# Altium project IMX6 DEV BOARD.PrjPcb (part 1 of 4)
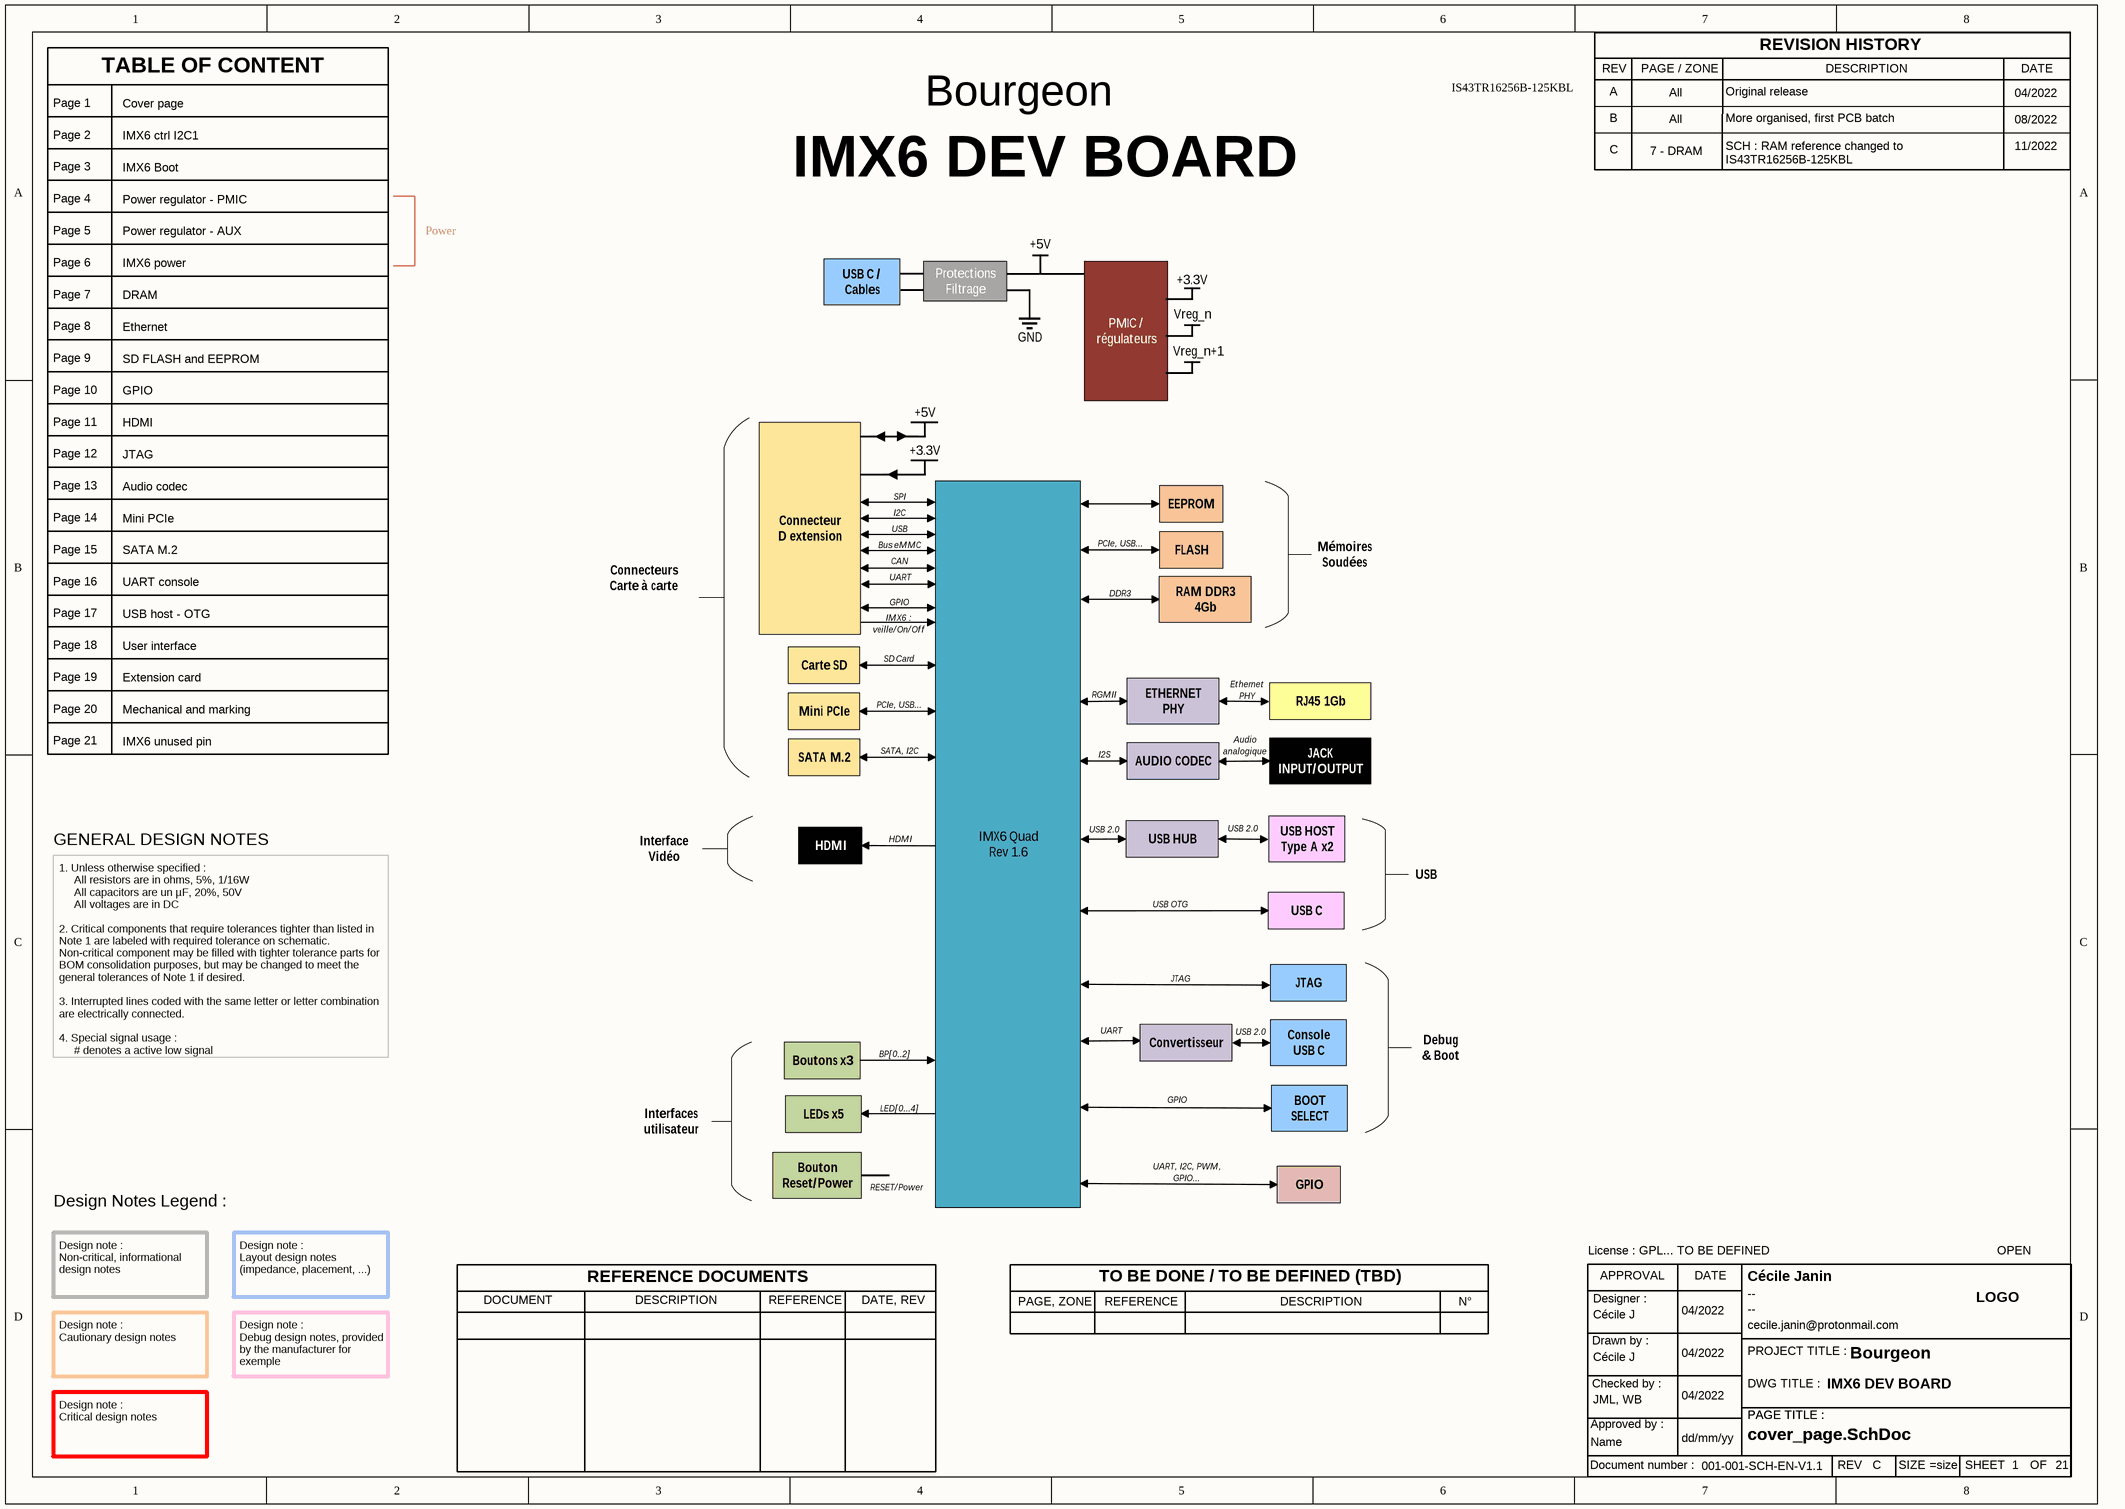
[diagram p0: cover_page.SchDoc]
society_phone: --; society_name: Cécile Janin; society_email_or_website: cecile.janin@protonmail.com; society_address: --; SCH_sensibility: OPEN; SCH_rev: C; SCH_license: License : GPL... TO BE DEFINED; SCH_drawn_by: Cécile J; SCH_doc_number: 001-001-SCH-EN-V1.1; SCH_design_by: Cécile J; SCH_date_dwg: 04/2022; SCH_date_dsgn: 04/2022; SCH_date_checked: 04/2022; SCH_date_approved: dd/mm/yy; SCH_checked_by: JML, WB; SCH_approved_by: Name; project_title: Bourgeon; PCB_sensibility: OPEN; PCB_scale: 1:1; PCB_rev: B; PCB_page_name: PCB1.PcbDoc; PCB_license: License : GPL... TO BE DEFINED; PCB_drawn_by: Cécile J; PCB_doc_number: 001-001-PCB-EN-V1.1; PCB_design_by: Cécile J; PCB_date_dwg: 05/2022; PCB_date_dsgn: 05/2022; PCB_date_checked: 05/2022; PCB_date_approved: dd/mm/yy; PCB_checked_by: JML, WB; PCB_approved_by: Name; dwg_title_article: IMX6 DEV BOARD
21 sheets, 712 parts. Net scope: flat (ports and power ports of the same name join across sheets).
Board files: First Board IMX6 Ed1.PcbDoc, IMX6 DEV BOARD.PcbDoc
Sheets:
  cover_page.SchDoc
  imx6_ctrl_i2c1.SchDoc
  imx6_boot.SchDoc
  power_regulator_pmic.SchDoc
  power_regulator_aux.SchDoc
  imx6_power.SchDoc
  dram.SchDoc
  ethernet.SchDoc
  sd_flash_eeprom.SchDoc
  gpio.SchDoc
  hdmi.SchDoc
  jtag.SchDoc
  audio_codec.SchDoc
  mini_pcie.SchDoc
  sata_m2.SchDoc
  uart_console.SchDoc
  usb_host_otg.SchDoc
  user_interface.SchDoc
  extension_card.SchDoc
  mechanical_marking.SchDoc
  imx6_unused_pin.SchDoc

## Sheet cover_page.SchDoc
size A3; SheetNumber: 1; SheetTotal: 21

### Parts
TB1  Title bloc ANSI modified  (value not drawn)

### Notes on the sheet
- Page 1
- TABLE OF CONTENT
- Cover page
- IS43TR16256B-125KBL
- REV
- A
- PAGE / ZONE
- All
- Original release
- REVISION HISTORY
- DESCRIPTION
- 04/2022
- DATE
- Page 2
- Page 3
- IMX6 ctrl I2C1
- IMX6 Boot
- B
- C
- 7 - DRAM
- More organised, first PCB batch
- SCH : RAM reference changed to IS43TR16256B-125KBL
- 08/2022
- 11/2022
- Page 4
- Page 5
- Power regulator - PMIC
- Power regulator - AUX
- Power
- Page 6
- Page 7
- IMX6 power
- DRAM
- Page 8
- Page 9
- Ethernet
- SD FLASH and EEPROM
- Page 10
- Page 11
- GPIO
- HDMI
- Page 12
- Page 13
- JTAG
- Audio codec
- Page 14
- Page 15
- Page 16
- Mini PCIe
- SATA M.2
- UART console
- Page 17
- Page 18
- USB host - OTG
- User interface
- Page 19
- Page 20
- Extension card
- Mechanical and marking
- Page 21
- IMX6 unused pin
- GENERAL DESIGN NOTES
- 1. Unless otherwise specified :
  All resistors are in ohms, 5%, 1/16W
  All capacitors are un µF, 20%, 50V
  All voltages are in DC
  2. Critical components that require tolerances tighter than listed in Note 1 are labeled with required tolerance on schematic. Non-critical component may be filled with tighter tolerance parts for BOM consolidation purposes, but may be changed to meet the general tolerances of Note 1 if desired.
  3. Interrupted lines coded with the same letter or letter combination are electrically connected.
  4. Special signal usage :
  # denotes a active low signal
- Design Notes Legend :
- Design note :
  Non-critical, informational design notes
- Design note :
  Layout design notes (impedance, placement, ...)
- DOCUMENT
- REFERENCE DOCUMENTS
- REFERENCE
- DATE, REV
- PAGE, ZONE
- TO BE DONE / TO BE DEFINED (TBD)
- N°
- Design note :
  Cautionary design notes
- Design note :
  Debug design notes, provided by the manufacturer for exemple
- Design note :
  Critical design notes
- (in symbol Title bloc ANSI) APPROVAL; DATE; Designer :; LOGO; Drawn by :; PROJECT TITLE :; Checked by :; DWG TITLE :; PAGE TITLE :; Approved by :; Document number :; REV; SIZE; SHEET; OF

### Library data of the parts
TB1 = Title bloc ANSI

## Sheet imx6_ctrl_i2c1.SchDoc
size A3; SheetNumber: 2; SheetTotal: 21
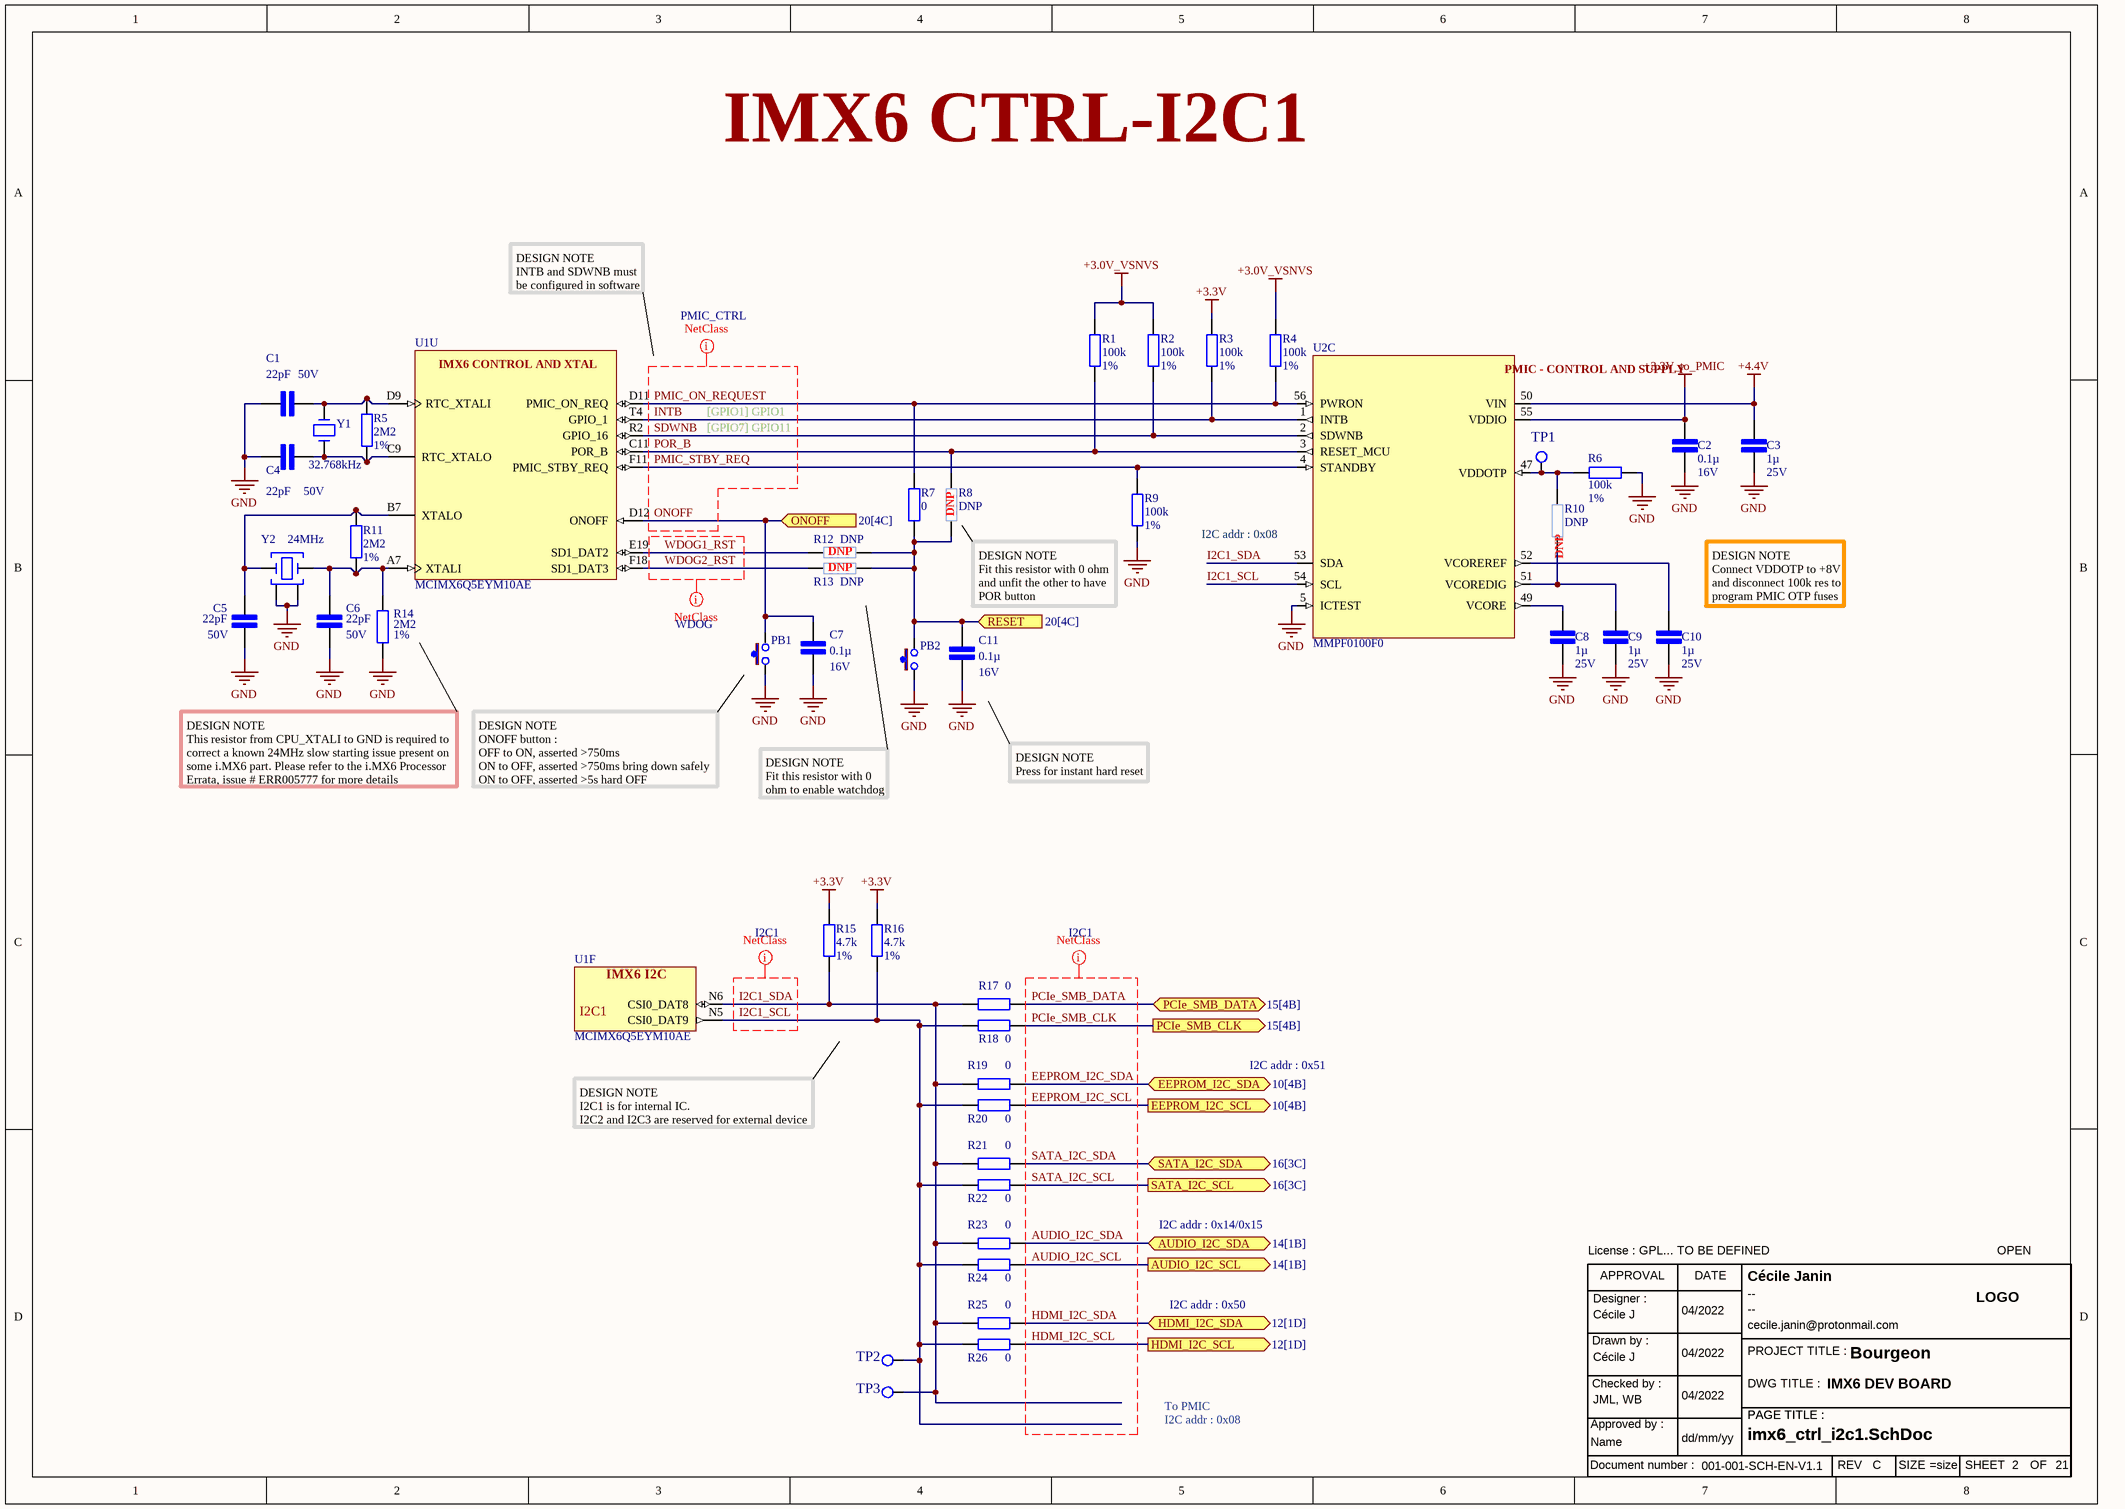
[diagram p1: imx6_ctrl_i2c1.SchDoc]

### Parts
C1  22pF  Tension du diélectrique: 50V  [Cap cer 0402/1005]
C2  0.1µ  Tension du diélectrique: 16V  [Cap cer 0402/1005]
C3  1µ  Tension du diélectrique: 25V  [Cap cer 0402/1005]
C4  22pF  Tension du diélectrique: 50V  [Cap cer 0402/1005]
C5  22pF  Tension du diélectrique: 50V  [Cap cer 0402/1005]
C6  22pF  Tension du diélectrique: 50V  [Cap cer 0402/1005]
C7  0.1µ  Tension du diélectrique: 16V  [Cap cer 0402/1005]
C8  1µ  Tension du diélectrique: 25V  [Cap cer 0402/1005]
C9  1µ  Tension du diélectrique: 25V  [Cap cer 0402/1005]
C10  1µ  Tension du diélectrique: 25V  [Cap cer 0402/1005]
C11  0.1µ  Tension du diélectrique: 16V  [Cap cer 0402/1005]
PB1  pb_434121025816  [pb_434121025816]  (value not drawn)
PB2  pb_434121025816  [pb_434121025816]  (value not drawn)
R1  100k  pourcentage: 1%  [Res 0402/1005]
R2  100k  pourcentage: 1%  [Res 0402/1005]
R3  100k  pourcentage: 1%  [Res 0402/1005]
R4  100k  pourcentage: 1%  [Res 0402/1005]
R5  2M2  pourcentage: 1%  [Res 0402/1005]
R6  100k  pourcentage: 1%  [Res 0402/1005]
R7  0  [Res 0603/1603]
R8  DNP  [Res 0603/1603]
R9  100k  pourcentage: 1%  [Res 0402/1005]
R10  DNP  [Res 0402/1005]
R11  2M2  pourcentage: 1%  [Res 0402/1005]
R12  DNP  [Res 0603/1603]
R13  DNP  [Res 0603/1603]
R14  2M2  pourcentage: 1%  [Res 0402/1005]
R15  4.7k  pourcentage: 1%  [Res 0402/1005]
R16  4.7k  pourcentage: 1%  [Res 0402/1005]
R17  0  [Res 0603/1603]
R18  0  [Res 0603/1603]
R19  0  [Res 0603/1603]
R20  0  [Res 0603/1603]
R21  0  [Res 0603/1603]
R22  0  [Res 0603/1603]
R23  0  [Res 0603/1603]
R24  0  [Res 0603/1603]
R25  0  [Res 0603/1603]
R26  0  [Res 0603/1603]
TB3  Title bloc ANSI modified  (value not drawn)
TP1  Test Point  [testpoint 1mm]  (value not drawn)
TP2  Test Point  [testpoint 1mm]  (value not drawn)
TP3  Test Point  [testpoint 1mm]  (value not drawn)
U1  MCIMX6Q5EYM10AE  [FRES-2197-01]  (parts F,U of 21)
U2  MMPF0100F0  [MMPF0100]  (part C of 3)
Y1  32.768kHz  [IQXC-25]
Y2  24MHz  [IQXC-42]

### Ports
AUDIO_I2C_SCL (out, see 14[1B]), AUDIO_I2C_SDA (bidir, see 14[1B]), EEPROM_I2C_SCL (out, see 10[4B]), EEPROM_I2C_SDA (bidir, see 10[4B]), HDMI_I2C_SCL (out, see 12[1D]), HDMI_I2C_SDA (bidir, see 12[1D]), ONOFF (in, see 20[4C]), PCIe_SMB_CLK (out, see 15[4B]), PCIe_SMB_DATA (bidir, see 15[4B]), RESET (in, see 20[4C]), SATA_I2C_SCL (out, see 16[3C]), SATA_I2C_SDA (bidir, see 16[3C])

### Nets
+3.0V_VSNVS: R1.2 R2.2 R4.2
+3.3V: R3.2 R15.2 R16.2
+3.3V_to_PMIC: C2.1 U2.55(VDDIO)
+4.4V: C3.1 U2.50(VIN)
GND: C1.2 C2.2 C3.2 C4.2 C5.2 C6.2 C7.2 C8.2 C9.2 C10.2 C11.2 PB1.1 PB2.1 R6.1 R9.1 R14.1 U2.5(ICTEST) Y2.2(GND) Y2.4(GND)
AUDIO_I2C_SCL: R24.2 ; port AUDIO_I2C_SCL
AUDIO_I2C_SDA: R23.2 ; port AUDIO_I2C_SDA
EEPROM_I2C_SCL: R20.2 ; port EEPROM_I2C_SCL
EEPROM_I2C_SDA: R19.2 ; port EEPROM_I2C_SDA
HDMI_I2C_SCL: R26.2 ; port HDMI_I2C_SCL
HDMI_I2C_SDA: R25.2 ; port HDMI_I2C_SDA
I2C1_SCL: R16.1 R18.1 R20.1 R22.1 R24.1 R26.1 TP2.1(tp) U1.N5(CSI0_DAT9) U2.54(SCL)
I2C1_SDA: R15.1 R17.1 R19.1 R21.1 R23.1 R25.1 TP3.1(tp) U1.N6(CSI0_DAT8) U2.53(SDA)
INTB: R3.1 U1.T4(GPIO_1) U2.1(INTB)
ONOFF: C7.1 PB1.2 U1.D12(ONOFF) ; port ONOFF
PCIe_SMB_CLK: R18.2 ; port PCIe_SMB_CLK
PCIe_SMB_DATA: R17.2 ; port PCIe_SMB_DATA
PMIC_ON_REQUEST: R4.1 R7.2 U1.D11(PMIC_ON_REQ) U2.56(PWRON)
PMIC_STBY_REQ: R9.2 U1.F11(PMIC_STBY_REQ) U2.4(STANDBY)
POR_B: R1.1 R8.2 U1.C11(POR_B) U2.3(RESET_MCU)
SATA_I2C_SCL: R22.2 ; port SATA_I2C_SCL
SATA_I2C_SDA: R21.2 ; port SATA_I2C_SDA
SDWNB: R2.1 U1.R2(GPIO_16) U2.2(SDWNB)
WDOG1_RST: R12.1 U1.E19(SD1_DAT2)
WDOG2_RST: R13.1 U1.F18(SD1_DAT3)
NetC1_1: C1.1 R5.2 U1.D9(RTC_XTALI) Y1.2(Crystal)
NetC4_1: C4.1 R5.1 U1.C9(RTC_XTALO) Y1.1(Crystal)
NetC5_1: C5.1 R11.2 U1.B7(XTALO) Y2.1(Crystal)
NetC6_1: C6.1 R11.1 R14.2 U1.A7(XTALI) Y2.3(Crystal)
NetC8_1: C8.1 U2.49(VCORE)
NetC9_1: C9.1 R10.1 U2.51(VCOREDIG)
NetC10_1: C10.1 U2.52(VCOREREF)
NetC11_1: C11.1 PB2.2 R7.1 R8.1 R12.2 R13.2 ; port RESET
NetR6_2: R6.2 R10.2 TP1.1(tp) U2.47(VDDOTP)

### Layout directives
net class I2C1: AUDIO_I2C_SCL, AUDIO_I2C_SDA, EEPROM_I2C_SCL, EEPROM_I2C_SDA, HDMI_I2C_SCL, HDMI_I2C_SDA, I2C1_SCL, I2C1_SDA, PCIe_SMB_CLK, PCIe_SMB_DATA, SATA_I2C_SCL, SATA_I2C_SDA
net class PMIC_CTRL: INTB, ONOFF, PMIC_ON_REQUEST, PMIC_STBY_REQ, POR_B, SDWNB
net class WDOG: WDOG1_RST, WDOG2_RST

### Notes on the sheet
- IMX6 CTRL-I2C1
- DESIGN NOTE
  INTB and SDWNB must be configured in software
- [GPIO1] GPIO1
- [GPIO7] GPIO11
- (near U2) I2C addr : 0x08
- DESIGN NOTE
  Fit this resistor with 0 ohm and unfit the other to have POR button
- (near C10) DESIGN NOTE
  Connect VDDOTP to +8V and disconnect 100k res to program PMIC OTP fuses
- DESIGN NOTE
  This resistor from CPU_XTALI to GND is required to
  correct a known 24MHz slow starting issue present on
  some i.MX6 part. Please refer to the i.MX6 Processor
  Errata, issue # ERR005777 for more details
- DESIGN NOTE
  ONOFF button :
  OFF to ON, asserted >750ms
  ON to OFF, asserted >750ms bring down safely
  ON to OFF, asserted >5s hard OFF
- DESIGN NOTE
  Press for instant hard reset
- DESIGN NOTE
  Fit this resistor with 0 ohm to enable watchdog
- DESIGN NOTE
  I2C1 is for internal IC.
  I2C2 and I2C3 are reserved for external device
- I2C addr : 0x51
- I2C addr : 0x14/0x15
- I2C addr : 0x50
- To PMIC
  I2C addr : 0x08
- (in symbol IC MMPF0100, part C) PMIC - CONTROL AND SUPPLY
- (in symbol IMX6Q5EYM10AE, part F) IMX6 I2C; I2C1
- (in symbol IMX6Q5EYM10AE, part U) IMX6 CONTROL AND XTAL
- (in symbol Title bloc ANSI) APPROVAL; DATE; Designer :; LOGO; Drawn by :; PROJECT TITLE :; Checked by :; DWG TITLE :; PAGE TITLE :; Approved by :; Document number :; REV; SIZE; SHEET; OF

### Library data of the parts
C1 C4-C6 = cap 22pF 50V: cap cer 22pF 50V 5% NP0 0402; Diélectrique: NP0
C2 C7 C11 = cap 0.1µ 16V: cap solid electrolyte 0.1µ 6.3V 10%; Diélectrique: X7R
C3 C8-C10 = cap 1µ 25V: cap cer 1µ 25V 10% X5R 0402; Diélectrique: X5R
R1-R4 R6 R9 = res 100k 1%: res 100k 1% 0402
R5 R11 R14 = res 2M2 1%: res 2M2 1% 0402
R7 R17-R26 = res 0Ohm: res 0603; pourcentage: --
R8 R12 R13 = res DNP 0603: pourcentage: 1%
R10 = res DNP: res DNP 0402; pourcentage: 1%
R15 R16 = res 4.7k 1%: res 4.7k 1% 0402
TB3 = Title bloc ANSI
TP1-TP3 = Test Point: Test point 1mm diameter
U1 = IMX6Q5EYM10AE: 32-Bit i.MX 6 Quad Application Processor, 1 GHz, 256 KB RAM, Extended Consumer Grade, 624-Pin FCPBGA, RoHS, Tape and Reel; PartNumber: MCIMX6Q5EYM10ACR; Manufacturer: Freescale Semiconductor; CAN: FlexCAN; Number of Cores: 4 Spec; External Memory Supported: DDR3, DDR3L, FLASH, LPDDR2; Speed Grade: 1 GHz; Core Type: ARM Cortex A9; Cache (KB): 32; Ethernet: 1 Gbps + IEEE 1588; Internal RAM (KB): 256; ComponentLink1Description: Manufacturer URL; ComponentLink2Description: Datasheet; DatasheetVersion: Rev. 2.3; ComponentLink3URL: http://cache.freescale.com/files/32bit/doc/data_sheet/IMX6DQCEC.pdf?fpsp=1&WT_TYPE=Data%20Sheets&WT_VENDOR=FREESCALE&WT_FILE_FORMAT=pdf&WT_ASSET=Documentation; ComponentLink1URL: http://www.freescale.com/; Packing: Tape and Reel; Temperature Range: -20 to 105 degC; ComponentLink2URL: http://cache.freescale.com/files/32bit/doc/data_sheet/IMX6DQCEC.pdf?fpsp=1&WT_TYPE=Data%20Sheets&WT_VENDOR=FREESCALE&WT_FILE_FORMAT=pdf&WT_ASSET=Documentation; ComponentLink3Description: Package Specification; PackageVersion: Rev. A; RoHS: TRUE; Quad/Dual CPU: i.MX 6Quad; Mounting Technology: Surface Mount; PackageReference: FCPBGA-624; PackageDescription: 624-pin Ball Grid Array Package, Body 21 x 21mm, Pitch 0.8mm
U2 = IC MMPF0100: PMIC; ComponentLink1Description: New link; ComponentLink1URL: D:\Carte_IMX6\datasheet\MMPF0100.pdf
Y1 = XTAL 32.768kHz: WE-XTAL, 25MHz, +/-10ppm 830062558
Y2 = XTAL 24MHz: WE-XTAL 24MHz, +/-10ppm / 830108212309; Manufacturer: Wurth Elektronik; Load Capacitance: 10pF; ComponentLink2Description: Datasheet; ComponentLink2URL: https://www.we-online.com/catalog/datasheet/830108212309.pdf; Operating Temperature: -20 to +70degC; Packaging: Tape and Reel; Manufacturer Part Number: 830108212309; Published Date: July 2020; Frequency Stability: +/-10ppm; Frequency: 24MHz; Frequency Tolerance: +/-10ppm; Mounting Technology: SMT

## Sheet imx6_boot.SchDoc
size A3; SheetNumber: 3; SheetTotal: 21
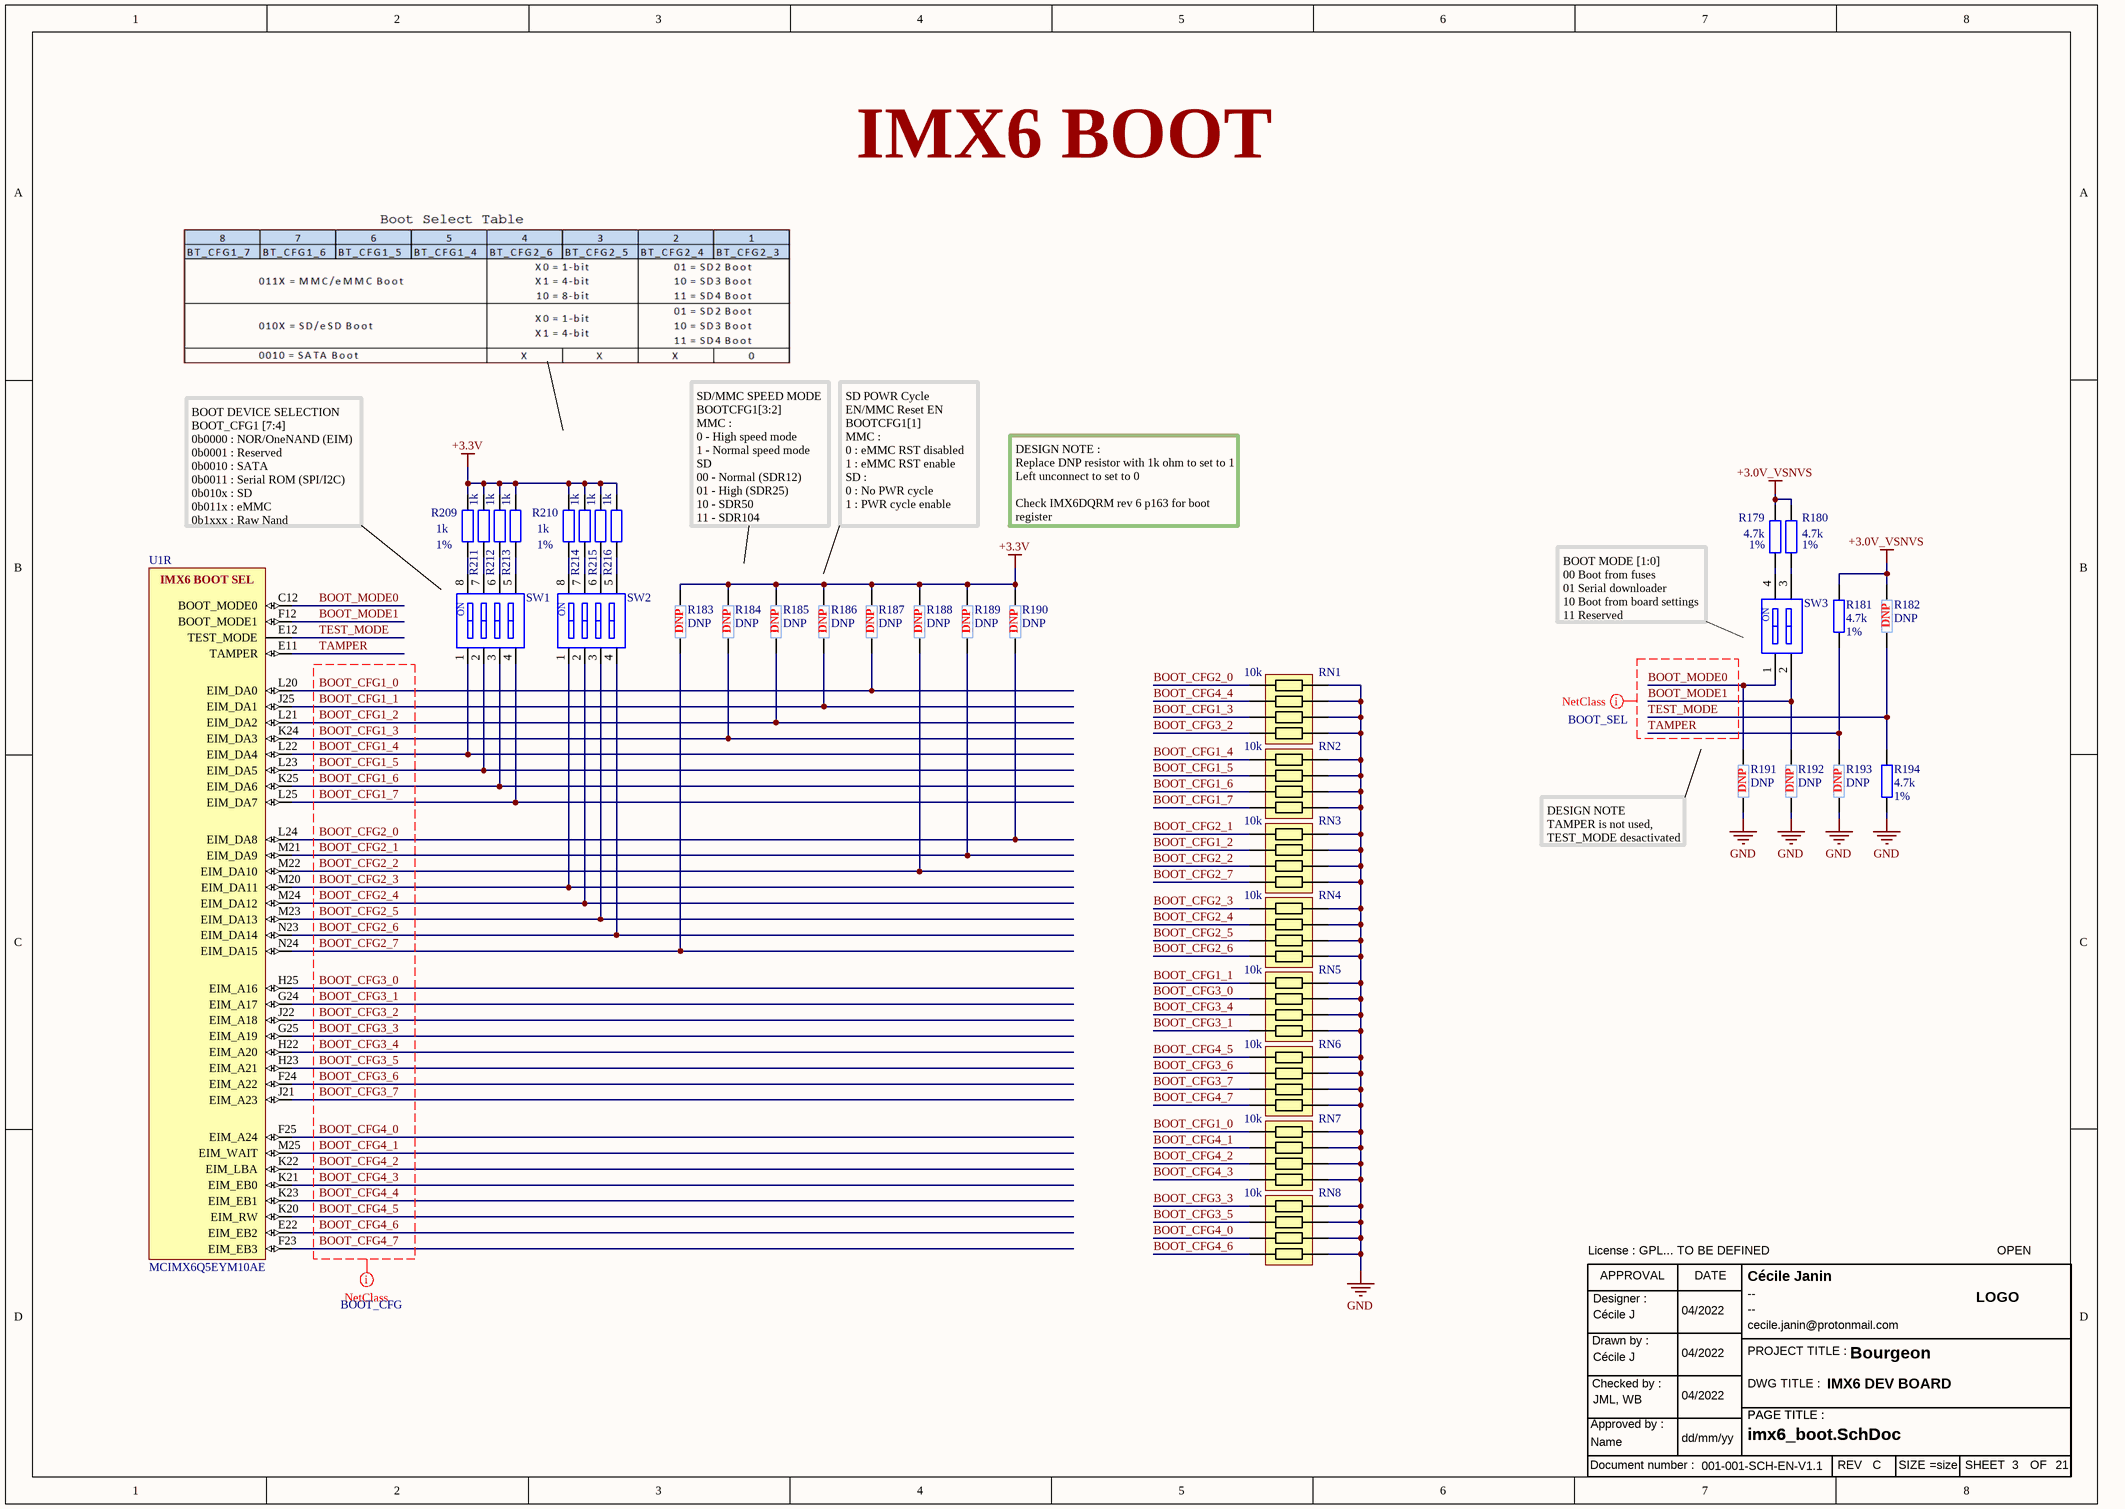
[diagram p2: imx6_boot.SchDoc]

### Parts
R179  4.7k  pourcentage: 1%  [Res 0402/1005]
R180  4.7k  pourcentage: 1%  [Res 0402/1005]
R181  4.7k  pourcentage: 1%  [Res 0402/1005]
R182  DNP  [Res 0402/1005]
R183  DNP  [Res 0402/1005]
R184  DNP  [Res 0402/1005]
R185  DNP  [Res 0402/1005]
R186  DNP  [Res 0402/1005]
R187  DNP  [Res 0402/1005]
R188  DNP  [Res 0402/1005]
R189  DNP  [Res 0402/1005]
R190  DNP  [Res 0402/1005]
R191  DNP  [Res 0402/1005]
R192  DNP  [Res 0402/1005]
R193  DNP  [Res 0402/1005]
R194  4.7k  pourcentage: 1%  [Res 0402/1005]
R209  1k  pourcentage: 1%  [Res 0402/1005]
R210  1k  pourcentage: 1%  [Res 0402/1005]
R211  1k  [Res 0402/1005]
R212  1k  [Res 0402/1005]
R213  1k  [Res 0402/1005]
R214  1k  [Res 0402/1005]
R215  1k  [Res 0402/1005]
R216  1k  [Res 0402/1005]
RN1  10k  [res net x4  EXB-28V103JX]
RN2  10k  [res net x4  EXB-28V103JX]
RN3  10k  [res net x4  EXB-28V103JX]
RN4  10k  [res net x4  EXB-28V103JX]
RN5  10k  [res net x4  EXB-28V103JX]
RN6  10k  [res net x4  EXB-28V103JX]
RN7  10k  [res net x4  EXB-28V103JX]
RN8  10k  [res net x4  EXB-28V103JX]
SW1  416131160804  [DIP SWITCH x4 1.27mm]  (value not drawn)
SW2  416131160804  [DIP SWITCH x4 1.27mm]  (value not drawn)
SW3  416131160802  [DIP switch x2 1.27mm]  (value not drawn)
TB20  Title bloc ANSI modified  (value not drawn)
U1  MCIMX6Q5EYM10AE  [FRES-2197-01]  (part R of 21)

### Nets
+3.0V_VSNVS: R179.2 R180.2 R181.2 R182.2
+3.3V: R183.2 R184.2 R185.2 R186.2 R187.2 R188.2 R189.2 R190.2 R209.2 R210.2 R211.2 R212.2 R213.2 R214.2 R215.2 R216.2
GND: R191.1 R192.1 R193.1 R194.1 RN1.5 RN1.6 RN1.7 RN1.8 RN2.1 RN2.2 RN2.3 RN2.4 RN3.5 RN3.6 RN3.7 RN3.8 RN4.1 RN4.2 RN4.3 RN4.4 RN5.5 RN5.6 RN5.7 RN5.8 RN6.5 RN6.6 RN6.7 RN6.8 RN7.5 RN7.6 RN7.7 RN7.8 RN8.5 RN8.6 RN8.7 RN8.8
BOOT_CFG1_0: R187.1 RN7.1 U1.L20(EIM_DA0)
BOOT_CFG1_1: R186.1 RN5.1 U1.J25(EIM_DA1)
BOOT_CFG1_2: R185.1 RN3.2 U1.L21(EIM_DA2)
BOOT_CFG1_3: R184.1 RN1.3 U1.K24(EIM_DA3)
BOOT_CFG1_4: RN2.8 SW1.1 U1.L22(EIM_DA4)
BOOT_CFG1_5: RN2.7 SW1.2 U1.L23(EIM_DA5)
BOOT_CFG1_6: RN2.6 SW1.3 U1.K25(EIM_DA6)
BOOT_CFG1_7: RN2.5 SW1.4 U1.L25(EIM_DA7)
BOOT_CFG2_0: R190.1 RN1.1 U1.L24(EIM_DA8)
BOOT_CFG2_1: R189.1 RN3.1 U1.M21(EIM_DA9)
BOOT_CFG2_2: R188.1 RN3.3 U1.M22(EIM_DA10)
BOOT_CFG2_3: RN4.8 SW2.1 U1.M20(EIM_DA11)
BOOT_CFG2_4: RN4.7 SW2.2 U1.M24(EIM_DA12)
BOOT_CFG2_5: RN4.6 SW2.3 U1.M23(EIM_DA13)
BOOT_CFG2_6: RN4.5 SW2.4 U1.N23(EIM_DA14)
BOOT_CFG2_7: R183.1 RN3.4 U1.N24(EIM_DA15)
BOOT_CFG3_0: RN5.2 U1.H25(EIM_A16)
BOOT_CFG3_1: RN5.4 U1.G24(EIM_A17)
BOOT_CFG3_2: RN1.4 U1.J22(EIM_A18)
BOOT_CFG3_3: RN8.1 U1.G25(EIM_A19)
BOOT_CFG3_4: RN5.3 U1.H22(EIM_A20)
BOOT_CFG3_5: RN8.2 U1.H23(EIM_A21)
BOOT_CFG3_6: RN6.2 U1.F24(EIM_A22)
BOOT_CFG3_7: RN6.3 U1.J21(EIM_A23)
BOOT_CFG4_0: RN8.3 U1.F25(EIM_A24)
BOOT_CFG4_1: RN7.2 U1.M25(EIM_WAIT)
BOOT_CFG4_2: RN7.3 U1.K22(EIM_LBA)
BOOT_CFG4_3: RN7.4 U1.K21(EIM_EB0)
BOOT_CFG4_4: RN1.2 U1.K23(EIM_EB1)
BOOT_CFG4_5: RN6.1 U1.K20(EIM_RW)
BOOT_CFG4_6: RN8.4 U1.E22(EIM_EB2)
BOOT_CFG4_7: RN6.4 U1.F23(EIM_EB3)
BOOT_MODE0: R191.2 SW3.1 U1.C12(BOOT_MODE0)
BOOT_MODE1: R192.2 SW3.2 U1.F12(BOOT_MODE1)
TAMPER: R181.1 R193.2 U1.E11(TAMPER)
TEST_MODE: R182.1 R194.2 U1.E12(TEST_MODE)
NetR179_1: R179.1 SW3.4
NetR180_1: R180.1 SW3.3
NetR209_1: R209.1 SW1.8
NetR210_1: R210.1 SW2.8
NetR211_1: R211.1 SW1.7
NetR212_1: R212.1 SW1.6
NetR213_1: R213.1 SW1.5
NetR214_1: R214.1 SW2.7
NetR215_1: R215.1 SW2.6
NetR216_1: R216.1 SW2.5

### Layout directives
net class BOOT_CFG: BOOT_CFG1_0, BOOT_CFG1_1, BOOT_CFG1_2, BOOT_CFG1_3, BOOT_CFG1_4, BOOT_CFG1_5, BOOT_CFG1_6, BOOT_CFG1_7, BOOT_CFG2_0, BOOT_CFG2_1, BOOT_CFG2_2, BOOT_CFG2_3, BOOT_CFG2_4, BOOT_CFG2_5, BOOT_CFG2_6, BOOT_CFG2_7, BOOT_CFG3_0, BOOT_CFG3_1, BOOT_CFG3_2, BOOT_CFG3_3, BOOT_CFG3_4, BOOT_CFG3_5, BOOT_CFG3_6, BOOT_CFG3_7, BOOT_CFG4_0, BOOT_CFG4_1, BOOT_CFG4_2, BOOT_CFG4_3, BOOT_CFG4_4, BOOT_CFG4_5, BOOT_CFG4_6, BOOT_CFG4_7
net class BOOT_SEL: BOOT_MODE0, BOOT_MODE1, TAMPER, TEST_MODE

### Notes on the sheet
- IMX6 BOOT
- BOOT DEVICE SELECTION
  BOOT_CFG1 [7:4]
  0b0000 : NOR/OneNAND (EIM)
  0b0001 : Reserved
  0b0010 : SATA
  0b0011 : Serial ROM (SPI/I2C)
  0b010x : SD
  0b011x : eMMC
  0b1xxx : Raw Nand
- SD/MMC SPEED MODE
  BOOTCFG1[3:2]
  MMC :
  0 - High speed mode
  1 - Normal speed mode
  SD
  00 - Normal (SDR12)
  01 - High (SDR25)
  10 - SDR50
  11 - SDR104
- SD POWR Cycle EN/MMC Reset EN
  BOOTCFG1[1]
  MMC :
  0 : eMMC RST disabled
  1 : eMMC RST enable
  SD :
  0 : No PWR cycle
  1 : PWR cycle enable
- DESIGN NOTE :
  Replace DNP resistor with 1k ohm to set to 1
  Left unconnect to set to 0
  Check IMX6DQRM rev 6 p163 for boot register
- BOOT MODE [1:0]
  00 Boot from fuses
  01 Serial downloader
  10 Boot from board settings
  11 Reserved
- DESIGN NOTE
  TAMPER is not used, TEST_MODE desactivated
- (in symbol DIP switch x2) ON
- (in symbol DIP switch x4) ON
- (in symbol IMX6Q5EYM10AE, part R) IMX6 BOOT SEL
- (in symbol Title bloc ANSI) APPROVAL; DATE; Designer :; LOGO; Drawn by :; PROJECT TITLE :; Checked by :; DWG TITLE :; PAGE TITLE :; Approved by :; Document number :; REV; SIZE; SHEET; OF

### Library data of the parts
R179-R181 R194 = res 4.7k 1%: res 4.7k 1% 0402
R182-R193 = res DNP 0402: res DNP 0403; pourcentage: 1%
R209-R216 = res 1k 1%: res 1k 1% 0402
  R211-R216: pourcentage: 1%
RN1-RN8 = res 10k net x4: resistor network 10k 5% x4 EXB-28V103JX
SW1 SW2 = DIP switch x4
SW3 = DIP switch x2
TB20 = Title bloc ANSI
U1 = IMX6Q5EYM10AE: as U1 on sheet imx6_ctrl_i2c1; ComponentLink1Description: Manufacturer URL; ComponentLink2Description: Datasheet; DatasheetVersion: Rev. 2.3; ComponentLink3URL: http://cache.freescale.com/files/32bit/doc/data_sheet/IMX6DQCEC.pdf?fpsp=1&WT_TYPE=Data%20Sheets&WT_VENDOR=FREESCALE&WT_FILE_FORMAT=pdf&WT_ASSET=Documentation; ComponentLink1URL: http://www.freescale.com/; Packing: Tape and Reel; Temperature Range: -20 to 105 degC; ComponentLink2URL: http://cache.freescale.com/files/32bit/doc/data_sheet/IMX6DQCEC.pdf?fpsp=1&WT_TYPE=Data%20Sheets&WT_VENDOR=FREESCALE&WT_FILE_FORMAT=pdf&WT_ASSET=Documentation; ComponentLink3Description: Package Specification; PackageVersion: Rev. A; RoHS: TRUE; Quad/Dual CPU: i.MX 6Quad; Mounting Technology: Surface Mount; PackageReference: FCPBGA-624; PackageDescription: 624-pin Ball Grid Array Package, Body 21 x 21mm, Pitch 0.8mm

## Sheet power_regulator_pmic.SchDoc
size A3; SheetNumber: 4; SheetTotal: 21
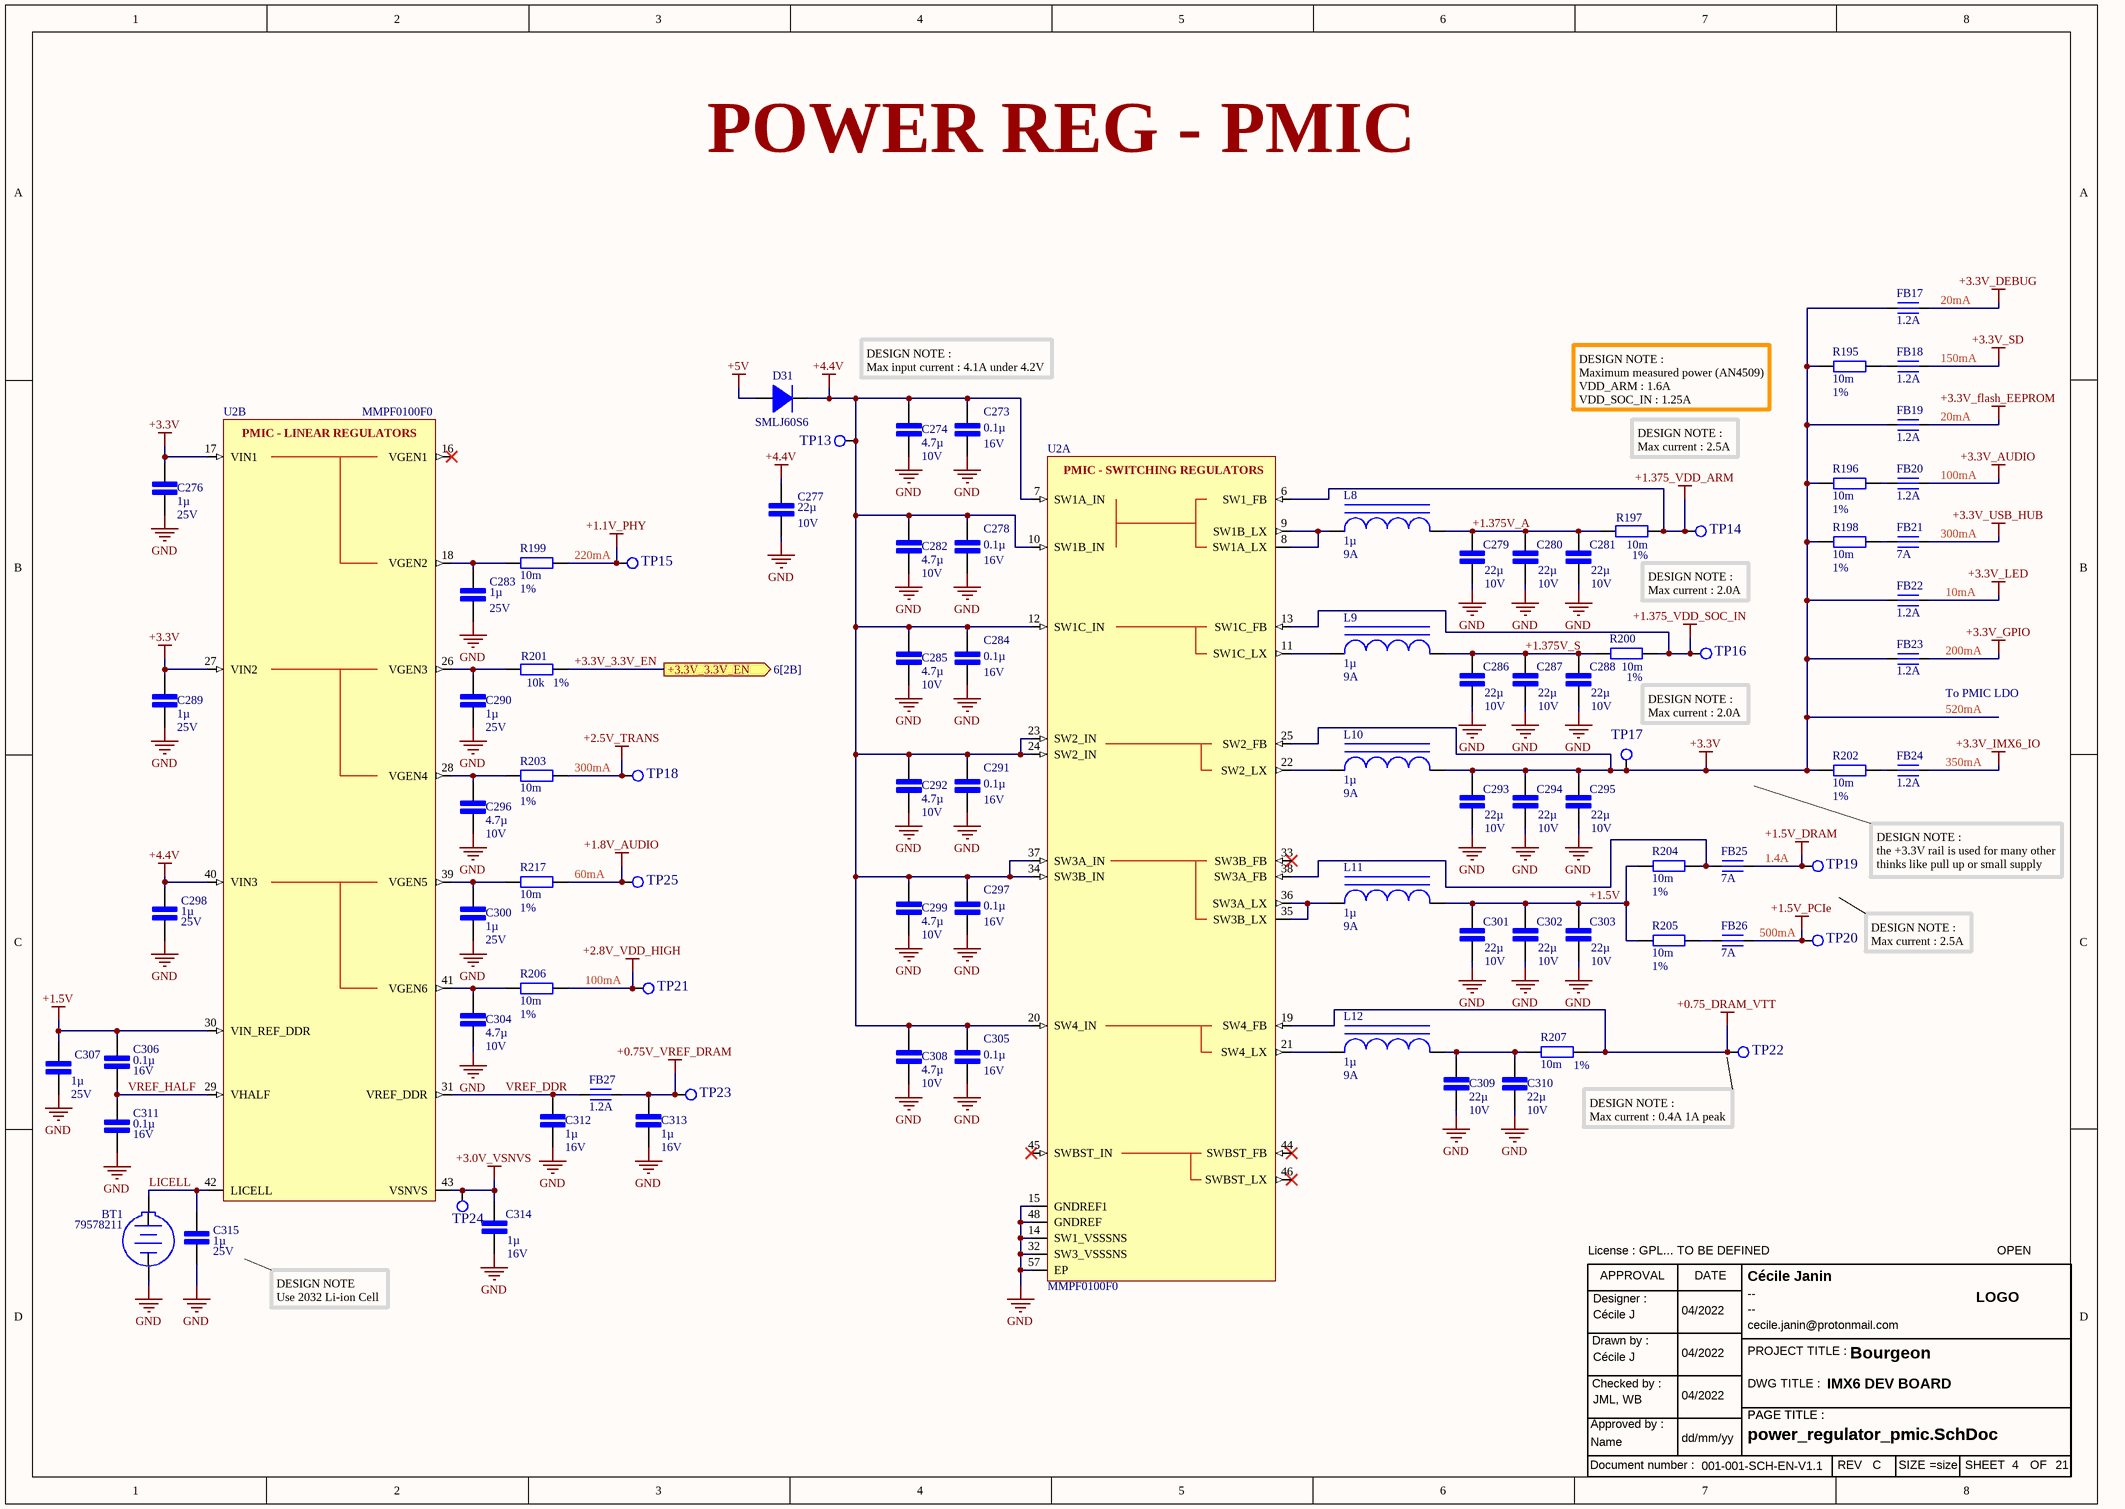
[diagram p3: power_regulator_pmic.SchDoc]

### Parts
BT1  79578211  [Battery holder]
C273  0.1µ  Tension du diélectrique: 16V  [Cap cer 0402/1005]
C274  4.7µ  Tension du diélectrique: 10V  [Cap cer 0402/1005]
C276  1µ  Tension du diélectrique: 25V  [Cap cer 0402/1005]
C277  22µ  Tension du diélectrique: 10V  [Cap cer 0603/4608]
C278  0.1µ  Tension du diélectrique: 16V  [Cap cer 0402/1005]
C279  22µ  Tension du diélectrique: 10V  [Cap cer 0603/4608]
C280  22µ  Tension du diélectrique: 10V  [Cap cer 0603/4608]
C281  22µ  Tension du diélectrique: 10V  [Cap cer 0603/4608]
C282  4.7µ  Tension du diélectrique: 10V  [Cap cer 0402/1005]
C283  1µ  Tension du diélectrique: 25V  [Cap cer 0402/1005]
C284  0.1µ  Tension du diélectrique: 16V  [Cap cer 0402/1005]
C285  4.7µ  Tension du diélectrique: 10V  [Cap cer 0402/1005]
C286  22µ  Tension du diélectrique: 10V  [Cap cer 0603/4608]
C287  22µ  Tension du diélectrique: 10V  [Cap cer 0603/4608]
C288  22µ  Tension du diélectrique: 10V  [Cap cer 0603/4608]
C289  1µ  Tension du diélectrique: 25V  [Cap cer 0402/1005]
C290  1µ  Tension du diélectrique: 25V  [Cap cer 0402/1005]
C291  0.1µ  Tension du diélectrique: 16V  [Cap cer 0402/1005]
C292  4.7µ  Tension du diélectrique: 10V  [Cap cer 0402/1005]
C293  22µ  Tension du diélectrique: 10V  [Cap cer 0603/4608]
C294  22µ  Tension du diélectrique: 10V  [Cap cer 0603/4608]
C295  22µ  Tension du diélectrique: 10V  [Cap cer 0603/4608]
C296  4.7µ  Tension du diélectrique: 10V  [Cap cer 0402/1005]
C297  0.1µ  Tension du diélectrique: 16V  [Cap cer 0402/1005]
C298  1µ  Tension du diélectrique: 25V  [Cap cer 0402/1005]
C299  4.7µ  Tension du diélectrique: 10V  [Cap cer 0402/1005]
C300  1µ  Tension du diélectrique: 25V  [Cap cer 0402/1005]
C301  22µ  Tension du diélectrique: 10V  [Cap cer 0603/4608]
C302  22µ  Tension du diélectrique: 10V  [Cap cer 0603/4608]
C303  22µ  Tension du diélectrique: 10V  [Cap cer 0603/4608]
C304  4.7µ  Tension du diélectrique: 10V  [Cap cer 0402/1005]
C305  0.1µ  Tension du diélectrique: 16V  [Cap cer 0402/1005]
C306  0.1µ  Tension du diélectrique: 16V  [Cap cer 0402/1005]
C307  1µ  Tension du diélectrique: 25V  [Cap cer 0402/1005]
C308  4.7µ  Tension du diélectrique: 10V  [Cap cer 0402/1005]
C309  22µ  Tension du diélectrique: 10V  [Cap cer 0603/4608]
C310  22µ  Tension du diélectrique: 10V  [Cap cer 0603/4608]
C311  0.1µ  Tension du diélectrique: 16V  [Cap cer 0402/1005]
C312  1µ  Tension du diélectrique: 16V  [Cap cer 0402/1005]
C313  1µ  Tension du diélectrique: 16V  [Cap cer 0402/1005]
C314  1µ  Tension du diélectrique: 16V  [Cap cer 0402/1005]
C315  1µ  Tension du diélectrique: 25V  [Cap cer 0402/1005]
D31  SMLJ60S6  [DO-214AB]
FB17  1.2A  [inductor 0402/1005]
FB18  1.2A  [inductor 0402/1005]
FB19  1.2A  [inductor 0402/1005]
FB20  1.2A  [inductor 0402/1005]
FB21  7A  [inductor 0603/1603]
FB22  1.2A  [inductor 0402/1005]
FB23  1.2A  [inductor 0402/1005]
FB24  1.2A  [inductor 0402/1005]
FB25  7A  [inductor 0603/1603]
FB26  7A  [inductor 0603/1603]
FB27  1.2A  [inductor 0402/1005]
L8  1µ  Saturation: 9A  [inductor 4020 MAPI]
L9  1µ  Saturation: 9A  [inductor 4020 MAPI]
L10  1µ  Saturation: 9A  [inductor 4020 MAPI]
L11  1µ  Saturation: 9A  [inductor 4020 MAPI]
L12  1µ  Saturation: 9A  [inductor 4020 MAPI]
R195  10m  pourcentage: 1%  [Res 0603/1603]
R196  10m  pourcentage: 1%  [Res 0603/1603]
R197  10m  pourcentage: 1%  [Res 0603/1603]
R198  10m  pourcentage: 1%  [Res 0603/1603]
R199  10m  pourcentage: 1%  [Res 0603/1603]
R200  10m  pourcentage: 1%  [Res 0603/1603]
R201  10k  pourcentage: 1%  [Res 0402/1005]
R202  10m  pourcentage: 1%  [Res 0603/1603]
R203  10m  pourcentage: 1%  [Res 0603/1603]
R204  10m  pourcentage: 1%  [Res 0603/1603]
R205  10m  pourcentage: 1%  [Res 0603/1603]
R206  10m  pourcentage: 1%  [Res 0603/1603]
R207  10m  pourcentage: 1%  [Res 0603/1603]
R217  10m  pourcentage: 1%  [Res 0603/1603]
TB21  Title bloc ANSI modified  (value not drawn)
TP13  Test Point  [testpoint 1mm]  (value not drawn)
TP14  Test Point  [testpoint 1mm]  (value not drawn)
TP15  Test Point  [testpoint 1mm]  (value not drawn)
TP16  Test Point  [testpoint 1mm]  (value not drawn)
TP17  Test Point  [testpoint 1mm]  (value not drawn)
TP18  Test Point  [testpoint 1mm]  (value not drawn)
TP19  Test Point  [testpoint 1mm]  (value not drawn)
TP20  Test Point  [testpoint 1mm]  (value not drawn)
TP21  Test Point  [testpoint 1mm]  (value not drawn)
TP22  Test Point  [testpoint 1mm]  (value not drawn)
TP23  Test Point  [testpoint 1mm]  (value not drawn)
TP24  Test Point  [testpoint 1mm]  (value not drawn)
TP25  Test Point  [testpoint 1mm]  (value not drawn)
U2  MMPF0100F0  [MMPF0100]  (parts A,B of 3)

### Ports
+3.3V_3.3V_EN (out, see 6[2B])

### Nets
+0.75_DRAM_VTT: R207.2 TP22.1(tp) U2.19(SW4_FB)
+0.75V_VREF_DRAM: C313.1 FB27.2 TP23.1(tp)
+1.1V_PHY: R199.2 TP15.1(tp)
+1.5V: C301.1 C302.1 C303.1 C306.1 C307.1 L11.2 R204.1 R205.1 U2.30(VIN_REF_DDR)
+1.5V_DRAM: FB25.2 TP19.1(tp)
+1.5V_PCIe: FB26.2 TP20.1(tp)
+1.8V_AUDIO: R217.2 TP25.1(tp)
+1.375_VDD_ARM: R197.2 TP14.1(tp) U2.6(SW1_FB)
+1.375_VDD_SOC_IN: R200.2 TP16.1(tp) U2.13(SW1C_FB)
+2.5V_TRANS: R203.2 TP18.1(tp)
+2.8V_VDD_HIGH: R206.2 TP21.1(tp)
+3.0V_VSNVS: C314.1 TP24.1(tp) U2.43(VSNVS)
+3.3V: C276.1 C289.1 C293.1 C294.1 C295.1 FB17.1 FB19.1 FB22.1 FB23.1 L10.2 R195.2 R196.1 R198.2 R202.1 TP17.1(tp) U2.17(VIN1) U2.25(SW2_FB) U2.27(VIN2)
+3.3V_AUDIO: FB20.2
+3.3V_DEBUG: FB17.2
+3.3V_flash_EEPROM: FB19.2
+3.3V_GPIO: FB23.2
+3.3V_IMX6_IO: FB24.2
+3.3V_LED: FB22.2
+3.3V_SD: FB18.2
+3.3V_USB_HUB: FB21.2
+4.4V: C273.1 C274.1 C277.1 C278.1 C282.1 C284.1 C285.1 C291.1 C292.1 C297.1 C298.1 C299.1 C305.1 C308.1 D31.K TP13.1(tp) U2.7(SW1A_IN) U2.10(SW1B_IN) U2.12(SW1C_IN) U2.20(SW4_IN) U2.23(SW2_IN) U2.24(SW2_IN) U2.34(SW3B_IN) U2.37(SW3A_IN) U2.40(VIN3)
+5V: D31.A
GND: BT1.2(-) C273.2 C274.2 C276.2 C277.2 C278.2 C279.2 C280.2 C281.2 C282.2 C283.2 C284.2 C285.2 C286.2 C287.2 C288.2 C289.2 C290.2 C291.2 C292.2 C293.2 C294.2 C295.2 C296.2 C297.2 C298.2 C299.2 C300.2 C301.2 C302.2 C303.2 C304.2 C305.2 C307.2 C308.2 C309.2 C310.2 C311.2 C312.2 C313.2 C314.2 C315.2 U2.14(SW1_VSSSNS) U2.15(GNDREF1) U2.32(SW3_VSSSNS) U2.48(GNDREF) U2.57(EP)
+1.375V_A: C279.1 C280.1 C281.1 L8.2 R197.1
+1.375V_S: C286.1 C287.1 C288.1 L9.2 R200.1
+3.3V_3.3V_EN: R201.2 ; port +3.3V_3.3V_EN
LICELL: BT1.1(+) C315.1 U2.42(LICELL)
VREF_DDR: C312.1 FB27.1 U2.31(VREF_DDR)
VREF_HALF: C306.2 C311.1 U2.29(VHALF)
NetC283_1: C283.1 R199.1 U2.18(VGEN2)
NetC290_1: C290.1 R201.1 U2.26(VGEN3)
NetC296_1: C296.1 R203.1 U2.28(VGEN4)
NetC300_1: C300.1 R217.1 U2.39(VGEN5)
NetC304_1: C304.1 R206.1 U2.41(VGEN6)
NetC309_1: C309.1 C310.1 L12.2 R207.1
NetFB18_1: FB18.1 R195.1
NetFB20_1: FB20.1 R196.2
NetFB21_1: FB21.1 R198.1
NetFB24_1: FB24.1 R202.2
NetFB25_1: FB25.1 R204.2 U2.38(SW3A_FB)
NetFB26_1: FB26.1 R205.2
NetL8_1: L8.1 U2.8(SW1A_LX) U2.9(SW1B_LX)
NetL9_1: L9.1 U2.11(SW1C_LX)
NetL10_1: L10.1 U2.22(SW2_LX)
NetL11_1: L11.1 U2.35(SW3B_LX) U2.36(SW3A_LX)
NetL12_1: L12.1 U2.21(SW4_LX)

Not connected (* = marked no-connect by the designer): U2 16(VGEN1)* 33(SW3B_FB)* 44(SWBST_FB)* 45(SWBST_IN)* 46(SWBST_LX)*

### Notes on the sheet
- POWER REG - PMIC
- (near FB17) 20mA
- DESIGN NOTE :
  Max input current : 4.1A under 4.2V
- (near FB18) 150mA
- DESIGN NOTE :
  Maximum measured power (AN4509)
  VDD_ARM : 1.6A
  VDD_SOC_IN : 1.25A
- DESIGN NOTE :
  Max current : 2.5A
- (near FB19) 20mA
- (near FB20) 100mA
- 220mA
- (near FB21) 300mA
- DESIGN NOTE :
  Max current : 2.0A
- (near FB22) 10mA
- (near FB23) 200mA
- (near FB23) To PMIC LDO
- 520mA
- 300mA
- (near FB24) 350mA
- 60mA
- 1.4A
- DESIGN NOTE :
  the +3.3V rail is used for many other thinks like pull up or small supply
- 100mA
- 500mA
- DESIGN NOTE :
  Max current : 0.4A 1A peak
- DESIGN NOTE
  Use 2032 Li-ion Cell
- (in symbol IC MMPF0100, part A) PMIC - SWITCHING REGULATORS
- (in symbol IC MMPF0100, part B) PMIC - LINEAR REGULATORS
- (in symbol Title bloc ANSI) APPROVAL; DATE; Designer :; LOGO; Drawn by :; PROJECT TITLE :; Checked by :; DWG TITLE :; PAGE TITLE :; Approved by :; Document number :; REV; SIZE; SHEET; OF

### Library data of the parts
BT1 = battery holder: WA-BCPH Battery Holder, THT, Battery Type 2450; Manufacturer: Wurth Elektronik; Battery Type: 2450; ComponentLink1Description: Manufacturer; ComponentLink1URL: http://www.we-online.de; ComponentLink2Description: Datasheet; ComponentLink2URL: https://www.we-online.com/catalog/datasheet/79578211.pdf; Manufacturer Part Number: 79578211; Mounting Technology: THT; Operating Temperature: -40 to +105degC; Published Date: July 2021; Packaging: Bag
C273 C278 C284 C291 C297 C305 = cap 0.1µ 4V: cap cer 0.1µ 16V 10% X7R 0402; Diélectrique: X7R
C274 C282 C285 C292 C296 C299 C304 C308 = cap 4.7µ 10V: cap cer 4.7µ 10V 10% X7R 0402; Diélectrique: X7R
C276 C283 C289 C290 C298 C300 C307 C315 = cap 1µ 25V: cap cer 1µ 25V 10% X5R 0402; Diélectrique: X5R
C277 C279-C281 C286-C288 C293-C295 C301-C303 C309 C310 = cap 22µ 10V: cap cer 22µ 10V 10% X5R 0603; Diélectrique: X5R
C306 C311 = cap 0.1µ 16V: as C2 on sheet imx6_ctrl_i2c1
C312-C314 = cap 1µ 16V: cap cer 1µ 16V 10% X7R 0402; Diélectrique: X7R
D31 = Diode 600V 6A: Diode 600V 6A DO-214AB
FB17-FB20 FB22-FB24 FB27 = Ferrite bead 0402: ferrite bead 1.2A 70mohm / 74269242111; ComponentLink1Description: New link; ComponentLink1URL: https://www.we-online.com/catalog/datasheet/74269242111.pdf
FB21 FB25 FB26 = Ferrite bead 0603: ferrite bead 17AA 2mohm / 7426926222; ComponentLink1Description: New link; ComponentLink1URL: https://www.we-online.com/catalog/datasheet/7426926222.pdf
L8-L12 = inductor 1.0µ 9A: inductor 1.0µ 9A sat 4020 74438356010
R195-R200 R202-R207 R217 = res 10m 1%: res 10m 1% 0.33W 0603
R201 = res 10k 1%: res 10k 1% 0402
TB21 = Title bloc ANSI
TP13-TP25 = Test Point: Test point 1mm diameter
U2 = IC MMPF0100: PMIC; ComponentLink1Description: New link; ComponentLink1URL: D:\Carte_IMX6\datasheet\MMPF0100.pdf

## Sheet power_regulator_aux.SchDoc
size A4; SheetNumber: 5; SheetTotal: 21
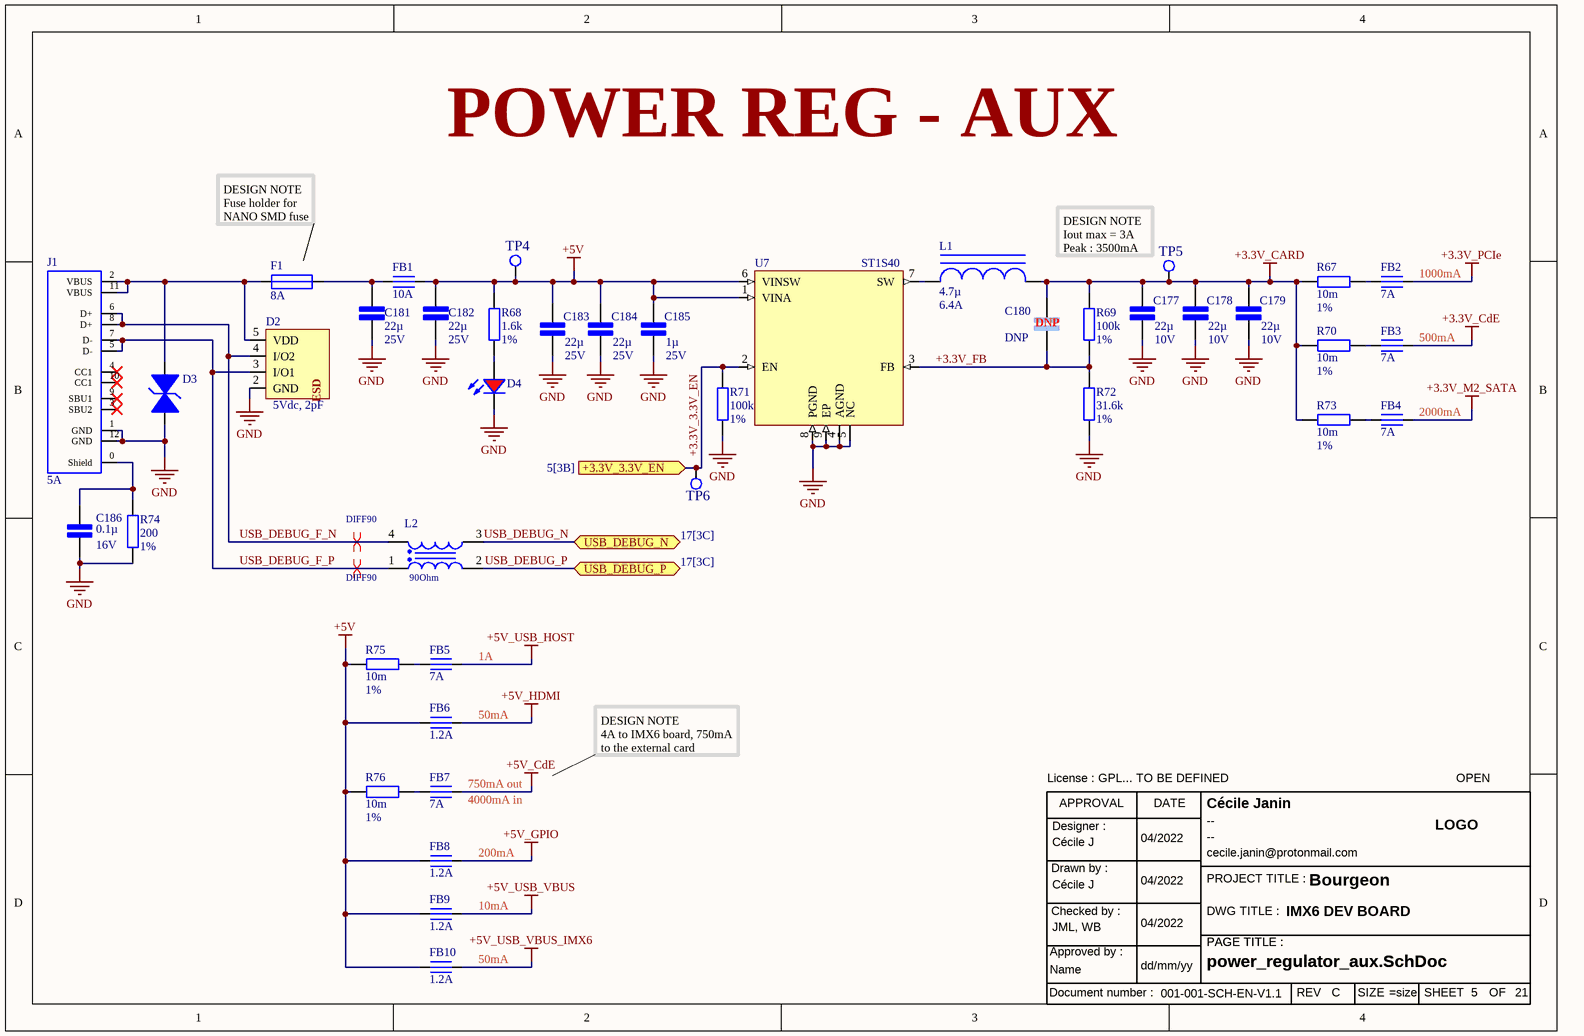
[diagram p4: power_regulator_aux.SchDoc]

### Parts
C177  22µ  Tension du diélectrique: 10V  [Cap cer 0603/4608]
C178  22µ  Tension du diélectrique: 10V  [Cap cer 0603/4608]
C179  22µ  Tension du diélectrique: 10V  [Cap cer 0603/4608]
C180  DNP  [Cap cer 0402/1005]
C181  22µ  Tension du diélectrique: 25V  [Cap cer 0805/2012]
C182  22µ  Tension du diélectrique: 25V  [Cap cer 0805/2012]
C183  22µ  Tension du diélectrique: 25V  [Cap cer 0805/2012]
C184  22µ  Tension du diélectrique: 25V  [Cap cer 0805/2012]
C185  1µ  Tension du diélectrique: 25V  [Cap cer 0402/1005]
C186  0.1µ  Tension du diélectrique: 16V  [Cap cer 0402/1005]
D2  5Vdc, 2pF  [Sot-23-5]
D3  TVS 5V  [inductor 0402/1005]  (value not drawn)
D4  Red, 2V, 120deg  [LED red 0603]  (value not drawn)
F1  8A  [Fuse holder SMD 01550900M]
FB1  10A  [Ferrite SMD 1612]
FB2  7A  [inductor 0603/1603]
FB3  7A  [inductor 0603/1603]
FB4  7A  [inductor 0603/1603]
FB5  7A  [inductor 0603/1603]
FB6  1.2A  [inductor 0402/1005]
FB7  7A  [inductor 0603/1603]
FB8  1.2A  [inductor 0402/1005]
FB9  1.2A  [inductor 0402/1005]
FB10  1.2A  [inductor 0402/1005]
J1  5A  [USB C 12 Pin EXT 629722000214]
L1  4.7µ  Saturation: 6.4A  [inductor 4030 74438357047]
L2  90Ohm  [inductor coupled usb 0603]
R67  10m  pourcentage: 1%  [Res 0603/1603]
R68  1.6k  pourcentage: 1%  [Res 0402/1005]
R69  100k  pourcentage: 1%  [Res 0402/1005]
R70  10m  pourcentage: 1%  [Res 0603/1603]
R71  100k  pourcentage: 1%  [Res 0402/1005]
R72  31.6k  pourcentage: 1%  [Res 0402/1005]
R73  10m  pourcentage: 1%  [Res 0603/1603]
R74  200  pourcentage: 1%  [Res 0402/1005]
R75  10m  pourcentage: 1%  [Res 0603/1603]
R76  10m  pourcentage: 1%  [Res 0603/1603]
TB6  Title bloc ANSI modified  (value not drawn)
TP4  Test Point  [testpoint 1mm]  (value not drawn)
TP5  Test Point  [testpoint 1mm]  (value not drawn)
TP6  Test Point  [testpoint 1mm]  (value not drawn)
U7  ST1S40  [SON 4x4 ST1S40]

### Ports
+3.3V_3.3V_EN (in, see 5[3B]), USB_DEBUG_N (bidir, see 17[3C]), USB_DEBUG_P (bidir, see 17[3C])

### Nets
+3.3V_CARD: C177.1 C178.1 C179.1 C180.1 L1.2 R67.1 R69.2 R70.1 R73.1 TP5.1(tp)
+3.3V_CdE: FB3.2
+3.3V_M2_SATA: FB4.2
+3.3V_PCIe: FB2.2
+5V: C182.1 C183.1 C184.1 C185.1 FB1.2 FB6.1 FB8.1 FB9.1 FB10.1 R68.2 R75.1 R76.1 TP4.1(tp) U7.1(VINA) U7.6(VINSW)
+5V_CdE: FB7.2
+5V_GPIO: FB8.2
+5V_HDMI: FB6.2
+5V_USB_HOST: FB5.2
+5V_USB_VBUS: FB9.2
+5V_USB_VBUS_IMX6: FB10.2
GND: C177.2 C178.2 C179.2 C181.2 C182.2 C183.2 C184.2 C185.2 C186.2 D2.2(GND) D3.2 D4.1(K) J1.1(GND) J1.12(GND) R71.1 R72.1 R74.1 U7.4(AGND) U7.5(NC) U7.8(PGND) U7.9(EP)
+3.3V_3.3V_EN: R71.2 TP6.1(tp) U7.2(EN) ; port +3.3V_3.3V_EN
+3.3V_FB: C180.2 R69.1 R72.2 U7.3(FB)
USB_DEBUG_F_N: D2.4(I/O2) J1.6(D+) J1.8(D+) L2.4
USB_DEBUG_F_P: D2.3(I/O1) J1.5(D-) J1.7(D-) L2.1
USB_DEBUG_N: L2.3 ; port USB_DEBUG_N
USB_DEBUG_P: L2.2 ; port USB_DEBUG_P
NetC181_1: C181.1 F1.2 FB1.1
NetC186_1: C186.1 J1.0(Shield) R74.2
NetD2_5: D2.5(VDD) D3.1 F1.1 J1.2(VBUS) J1.11(VBUS)
NetD4_2: D4.2(A) R68.1
NetFB2_1: FB2.1 R67.2
NetFB3_1: FB3.1 R70.2
NetFB4_1: FB4.1 R73.2
NetFB5_1: FB5.1 R75.2
NetFB7_1: FB7.1 R76.2
NetL1_1: L1.1 U7.7(SW)

Not connected (* = marked no-connect by the designer): J1 3(SBU2)* 4(CC1)* 9(SBU1)* 10(CC1)*

### Layout directives
differential pair; differential pair class DIFF90: USB_DEBUG_F_N, USB_DEBUG_F_P

### Notes on the sheet
- POWER REG - AUX
- DESIGN NOTE
  Fuse holder for NANO SMD fuse
- (near TP5) DESIGN NOTE
  Iout max = 3A
  Peak : 3500mA
- (near FB2) 1000mA
- (near FB3) 500mA
- (near FB4) 2000mA
- (near FB6) 50mA
- (near FB5) 1A
- (near FB7) 750mA out
- DESIGN NOTE
  4A to IMX6 board, 750mA to the external card
- (near FB7) 4000mA in
- (near FB8) 200mA
- (near FB9) 10mA
- (near FB10) 50mA
- (in symbol Title bloc ANSI) APPROVAL; DATE; Designer :; LOGO; Drawn by :; PROJECT TITLE :; Checked by :; DWG TITLE :; PAGE TITLE :; Approved by :; Document number :; REV; SIZE; SHEET; OF
- (in symbol TVS USB 824011) ESD

### Library data of the parts
C177-C179 = cap 22µ 10V: cap cer 22µ 10V 10% X5R 0603; Diélectrique: X5R
C180 = cap DNP: cap cer DNP 0402
C181-C184 = cap 22µ 25V: cap cer 22µ 25V 10% X5R 0805; Diélectrique: X5R
C185 = cap 1µ 25V: cap cer 1µ 25V 10% X5R 0402; Diélectrique: X5R
C186 = cap 0.1µ 16V: as C2 on sheet imx6_ctrl_i2c1
D2 = TVS USB 824011: WE-TVS TVS Diode – High Speed Series, SOT23-5L, 2+1 Channel, 5Vdc, 2pF; Manufacturer Part Number: 824011; Manufacturer: Wurth Elektronik; Reverse Peak Pulse Current: 13A; Channel ESD Clamping Voltage: 13V; Channel Operating Voltage: 5V; Channel Reverse Leakage Current: 1uA; ESD Air Discharge Capability: 24kV; ESD Contact Discharge Capability: 16kV; Polarity: Unidirectional; Reverse Breakdown Voltage: 6.1V; ComponentLink1Description: Manufacturer Link; ComponentLink1URL: http://www.we-online.de; ComponentLink2Description: Datasheet; ComponentLink2URL: https://www.we-online.com/catalog/datasheet/824011.pdf; Size: SOT23-5L; Mounting Technology: SMT; Packaging: Tape and Reel; Channel Input Capacitance: 2pF; Channel Number: 2+1; Height: 1.16mm; Length: 2.9mm; Operating Temperature max.: 125C; Operating Temperature min.: -55C; Width: 2.8mm
D3 = TVS suppressor 82357120050: 82357120050; ComponentLink1Description: New link; ComponentLink1URL: https://www.we-online.com/catalog/datasheet/82357120050.pdf
D4 = LED Red 0603: WL-SMCC SMD Mono-color Chip LED Compact, size 0603, Red, 2V, 120deg 150060RS73220; Dominant Wavelength: 624nm; Luminous Intensity: 90mcd; Peak Wavelength: 632nm; Chip Technology: AlInGaP; ComponentLink1URL: http://www.we-online.de; ComponentLink2Description: Datasheet; ComponentLink2URL: https://katalog.we-online.com/led/datasheet/150060RS73220.pdf; Part Number: 150060RS73220; Published Date: July 2019; Publisher: Wurth Elektronik; Size: 0603; Viewing Angle: 120deg; Packaging: Tape and Reel; Emitting Color: Red; Mounting Technology: SMT; Forward Voltage: 2V; Operating Temperature: -40 to +85degC
F1 = Fuse_8A_SMD: Fuse 6A SMD 2410 / NANO; ComponentLink1Description: New link; ComponentLink1URL: https://www.mouser.fr/datasheet/2/240/Littelfuse_Fuse_154_154T_154L_154TL_Datasheet_pdf-365375.pdf
FB1 = Ferrite bead 1612: ferrite bead 10A 2.5m Ohm / 74279223560; ComponentLink1Description: New link; ComponentLink1URL: https://www.we-online.com/catalog/datasheet/74279223560.pdf
FB2-FB5 FB7 = Ferrite bead 0603: ferrite bead 17AA 2mohm / 7426926222; ComponentLink1Description: New link; ComponentLink1URL: https://www.we-online.com/catalog/datasheet/7426926222.pdf
FB6 FB8-FB10 = Ferrite bead 0402: ferrite bead 1.2A 70mohm / 74269242111; ComponentLink1Description: New link; ComponentLink1URL: https://www.we-online.com/catalog/datasheet/74269242111.pdf
J1 = USB C 12 pin EXT 629722000214: 629722000214 wurth connector, up to 5A, with bottom pads for more cables
L1 = inductor 4.7µ 6.4A: inductor 4.7µ 6.4A sat 4030 / 74438357047; ComponentLink1Description: New link; ComponentLink1URL: https://www.we-online.com/catalog/datasheet/74438357047.pdf
L2 = inductor coupled USB: WE-CNSW SMT Common Mode Line Filter, size 0603, 90Ohm, 0.55A, 50V; Manufacturer Part Number: 744230900; Manufacturer: Wurth Elektronik; DC Resistance max.: 0.145Ohm; Impedance Test Condition: 100MHz; Insulation Test Voltage: 125VAC; Winding Style: bifiliar; ComponentLink1Description: Manufacturer; ComponentLink1URL: http://www.we-online.de; ComponentLink2Description: Datasheet; ComponentLink2URL: https://www.we-online.com/catalog/datasheet/744230900.pdf; Operating Temperature: -40 to +125degC; Packaging: Tape and Reel; Published Date: April 2020; Rated Current: 0.55A; Size: 0603; Impedance: 90Ohm; Rated Voltage: 50V; Mounting Technology: SMT
R67 R70 R73 R75 R76 = res 10m 1%: res 10m 1% 0.33W 0603
R68 = res 1.6k 1%: res 1.6k 1% 0402
R69 R71 = res 100k 1%: res 100k 1% 0402
R72 = res 31.6k 1%: res 31.6k 1% 0402
R74 = res 200 1%: res 200 1% 0402
TB6 = Title bloc ANSI
TP4-TP6 = Test Point: Test point 1mm diameter
U7 = IC ST1S40 QFN: switching regulator

## Sheet imx6_power.SchDoc
size A3; SheetNumber: 6; SheetTotal: 21
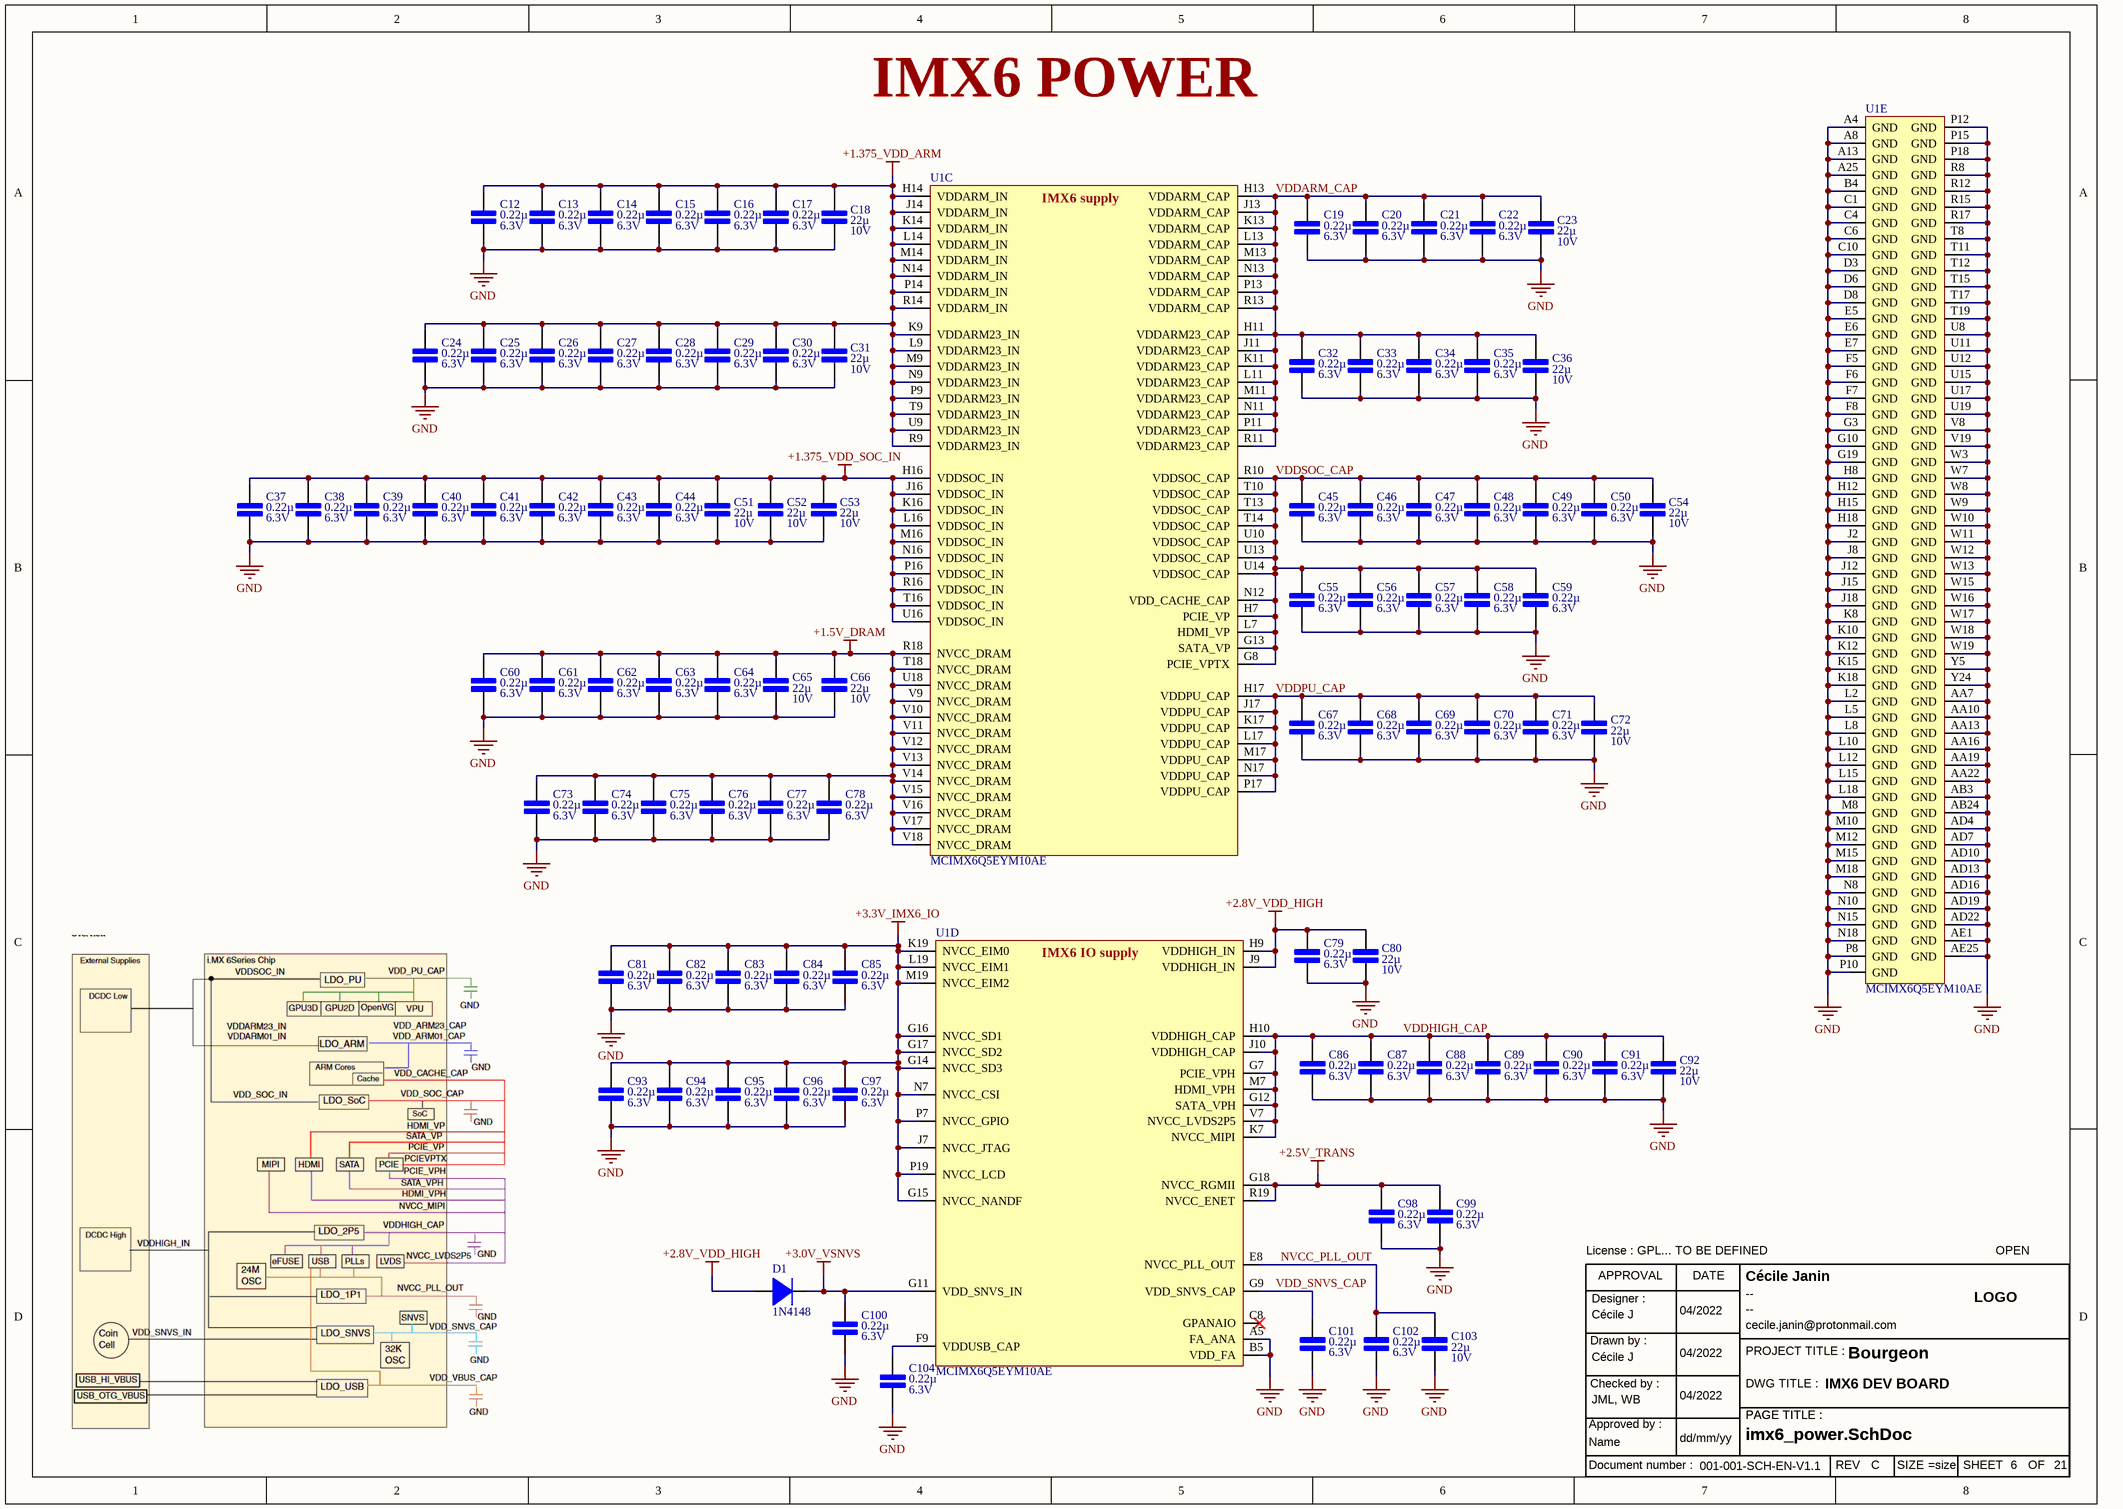
[diagram p5: imx6_power.SchDoc]

### Parts
C12  0.22µ  Tension du diélectrique: 6.3V  [CAP CER 0201/0603]
C13  0.22µ  Tension du diélectrique: 6.3V  [CAP CER 0201/0603]
C14  0.22µ  Tension du diélectrique: 6.3V  [CAP CER 0201/0603]
C15  0.22µ  Tension du diélectrique: 6.3V  [CAP CER 0201/0603]
C16  0.22µ  Tension du diélectrique: 6.3V  [CAP CER 0201/0603]
C17  0.22µ  Tension du diélectrique: 6.3V  [CAP CER 0201/0603]
C18  22µ  Tension du diélectrique: 10V  [Cap cer 0603/4608]
C19  0.22µ  Tension du diélectrique: 6.3V  [CAP CER 0201/0603]
C20  0.22µ  Tension du diélectrique: 6.3V  [CAP CER 0201/0603]
C21  0.22µ  Tension du diélectrique: 6.3V  [CAP CER 0201/0603]
C22  0.22µ  Tension du diélectrique: 6.3V  [CAP CER 0201/0603]
C23  22µ  Tension du diélectrique: 10V  [Cap cer 0603/4608]
C24  0.22µ  Tension du diélectrique: 6.3V  [CAP CER 0201/0603]
C25  0.22µ  Tension du diélectrique: 6.3V  [CAP CER 0201/0603]
C26  0.22µ  Tension du diélectrique: 6.3V  [CAP CER 0201/0603]
C27  0.22µ  Tension du diélectrique: 6.3V  [CAP CER 0201/0603]
C28  0.22µ  Tension du diélectrique: 6.3V  [CAP CER 0201/0603]
C29  0.22µ  Tension du diélectrique: 6.3V  [CAP CER 0201/0603]
C30  0.22µ  Tension du diélectrique: 6.3V  [CAP CER 0201/0603]
C31  22µ  Tension du diélectrique: 10V  [Cap cer 0603/4608]
C32  0.22µ  Tension du diélectrique: 6.3V  [CAP CER 0201/0603]
C33  0.22µ  Tension du diélectrique: 6.3V  [CAP CER 0201/0603]
C34  0.22µ  Tension du diélectrique: 6.3V  [CAP CER 0201/0603]
C35  0.22µ  Tension du diélectrique: 6.3V  [CAP CER 0201/0603]
C36  22µ  Tension du diélectrique: 10V  [Cap cer 0603/4608]
C37  0.22µ  Tension du diélectrique: 6.3V  [CAP CER 0201/0603]
C38  0.22µ  Tension du diélectrique: 6.3V  [CAP CER 0201/0603]
C39  0.22µ  Tension du diélectrique: 6.3V  [CAP CER 0201/0603]
C40  0.22µ  Tension du diélectrique: 6.3V  [CAP CER 0201/0603]
C41  0.22µ  Tension du diélectrique: 6.3V  [CAP CER 0201/0603]
C42  0.22µ  Tension du diélectrique: 6.3V  [CAP CER 0201/0603]
C43  0.22µ  Tension du diélectrique: 6.3V  [CAP CER 0201/0603]
C44  0.22µ  Tension du diélectrique: 6.3V  [CAP CER 0201/0603]
C45  0.22µ  Tension du diélectrique: 6.3V  [CAP CER 0201/0603]
C46  0.22µ  Tension du diélectrique: 6.3V  [CAP CER 0201/0603]
C47  0.22µ  Tension du diélectrique: 6.3V  [CAP CER 0201/0603]
C48  0.22µ  Tension du diélectrique: 6.3V  [CAP CER 0201/0603]
C49  0.22µ  Tension du diélectrique: 6.3V  [CAP CER 0201/0603]
C50  0.22µ  Tension du diélectrique: 6.3V  [CAP CER 0201/0603]
C51  22µ  Tension du diélectrique: 10V  [Cap cer 0603/4608]
C52  22µ  Tension du diélectrique: 10V  [Cap cer 0603/4608]
C53  22µ  Tension du diélectrique: 10V  [Cap cer 0603/4608]
C54  22µ  Tension du diélectrique: 10V  [Cap cer 0603/4608]
C55  0.22µ  Tension du diélectrique: 6.3V  [CAP CER 0201/0603]
C56  0.22µ  Tension du diélectrique: 6.3V  [CAP CER 0201/0603]
C57  0.22µ  Tension du diélectrique: 6.3V  [CAP CER 0201/0603]
C58  0.22µ  Tension du diélectrique: 6.3V  [CAP CER 0201/0603]
C59  0.22µ  Tension du diélectrique: 6.3V  [CAP CER 0201/0603]
C60  0.22µ  Tension du diélectrique: 6.3V  [CAP CER 0201/0603]
C61  0.22µ  Tension du diélectrique: 6.3V  [CAP CER 0201/0603]
C62  0.22µ  Tension du diélectrique: 6.3V  [CAP CER 0201/0603]
C63  0.22µ  Tension du diélectrique: 6.3V  [CAP CER 0201/0603]
C64  0.22µ  Tension du diélectrique: 6.3V  [CAP CER 0201/0603]
C65  22µ  Tension du diélectrique: 10V  [Cap cer 0603/4608]
C66  22µ  Tension du diélectrique: 10V  [Cap cer 0603/4608]
C67  0.22µ  Tension du diélectrique: 6.3V  [CAP CER 0201/0603]
C68  0.22µ  Tension du diélectrique: 6.3V  [CAP CER 0201/0603]
C69  0.22µ  Tension du diélectrique: 6.3V  [CAP CER 0201/0603]
C70  0.22µ  Tension du diélectrique: 6.3V  [CAP CER 0201/0603]
C71  0.22µ  Tension du diélectrique: 6.3V  [CAP CER 0201/0603]
C72  22µ  Tension du diélectrique: 10V  [Cap cer 0603/4608]
C73  0.22µ  Tension du diélectrique: 6.3V  [CAP CER 0201/0603]
C74  0.22µ  Tension du diélectrique: 6.3V  [CAP CER 0201/0603]
C75  0.22µ  Tension du diélectrique: 6.3V  [CAP CER 0201/0603]
C76  0.22µ  Tension du diélectrique: 6.3V  [CAP CER 0201/0603]
C77  0.22µ  Tension du diélectrique: 6.3V  [CAP CER 0201/0603]
C78  0.22µ  Tension du diélectrique: 6.3V  [CAP CER 0201/0603]
C79  0.22µ  Tension du diélectrique: 6.3V  [CAP CER 0201/0603]
C80  22µ  Tension du diélectrique: 10V  [Cap cer 0603/4608]
C81  0.22µ  Tension du diélectrique: 6.3V  [CAP CER 0201/0603]
C82  0.22µ  Tension du diélectrique: 6.3V  [CAP CER 0201/0603]
C83  0.22µ  Tension du diélectrique: 6.3V  [CAP CER 0201/0603]
C84  0.22µ  Tension du diélectrique: 6.3V  [CAP CER 0201/0603]
C85  0.22µ  Tension du diélectrique: 6.3V  [CAP CER 0201/0603]
C86  0.22µ  Tension du diélectrique: 6.3V  [CAP CER 0201/0603]
C87  0.22µ  Tension du diélectrique: 6.3V  [CAP CER 0201/0603]
C88  0.22µ  Tension du diélectrique: 6.3V  [CAP CER 0201/0603]
C89  0.22µ  Tension du diélectrique: 6.3V  [CAP CER 0201/0603]
C90  0.22µ  Tension du diélectrique: 6.3V  [CAP CER 0201/0603]
C91  0.22µ  Tension du diélectrique: 6.3V  [CAP CER 0201/0603]
C92  22µ  Tension du diélectrique: 10V  [Cap cer 0603/4608]
C93  0.22µ  Tension du diélectrique: 6.3V  [CAP CER 0201/0603]
C94  0.22µ  Tension du diélectrique: 6.3V  [CAP CER 0201/0603]
C95  0.22µ  Tension du diélectrique: 6.3V  [CAP CER 0201/0603]
C96  0.22µ  Tension du diélectrique: 6.3V  [CAP CER 0201/0603]
C97  0.22µ  Tension du diélectrique: 6.3V  [CAP CER 0201/0603]
C98  0.22µ  Tension du diélectrique: 6.3V  [CAP CER 0201/0603]
C99  0.22µ  Tension du diélectrique: 6.3V  [CAP CER 0201/0603]
C100  0.22µ  Tension du diélectrique: 6.3V  [CAP CER 0201/0603]
C101  0.22µ  Tension du diélectrique: 6.3V  [CAP CER 0201/0603]
C102  0.22µ  Tension du diélectrique: 6.3V  [CAP CER 0201/0603]
C103  22µ  Tension du diélectrique: 10V  [Cap cer 0603/4608]
C104  0.22µ  Tension du diélectrique: 6.3V  [CAP CER 0201/0603]
D1  1N4148  [diode SOD-123]
TB4  Title bloc ANSI modified  (value not drawn)
U1  MCIMX6Q5EYM10AE  [FRES-2197-01]  (parts C,D,E of 21)

### Nets
+1.5V_DRAM: C60.1 C61.1 C62.1 C63.1 C64.1 C65.1 C66.1 C73.1 C74.1 C75.1 C76.1 C77.1 C78.1 U1.R18(NVCC_DRAM) U1.T18(NVCC_DRAM) U1.U18(NVCC_DRAM) U1.V9(NVCC_DRAM) U1.V10(NVCC_DRAM) U1.V11(NVCC_DRAM) U1.V12(NVCC_DRAM) U1.V13(NVCC_DRAM) U1.V14(NVCC_DRAM) U1.V15(NVCC_DRAM) U1.V16(NVCC_DRAM) U1.V17(NVCC_DRAM) U1.V18(NVCC_DRAM)
+1.375_VDD_ARM: C12.1 C13.1 C14.1 C15.1 C16.1 C17.1 C18.1 C24.1 C25.1 C26.1 C27.1 C28.1 C29.1 C30.1 C31.1 U1.H14(VDDARM_IN) U1.J14(VDDARM_IN) U1.K9(VDDARM23_IN) U1.K14(VDDARM_IN) U1.L9(VDDARM23_IN) U1.L14(VDDARM_IN) U1.M9(VDDARM23_IN) U1.M14(VDDARM_IN) U1.N9(VDDARM23_IN) U1.N14(VDDARM_IN) U1.P9(VDDARM23_IN) U1.P14(VDDARM_IN) U1.R9(VDDARM23_IN) U1.R14(VDDARM_IN) U1.T9(VDDARM23_IN) U1.U9(VDDARM23_IN)
+1.375_VDD_SOC_IN: C37.1 C38.1 C39.1 C40.1 C41.1 C42.1 C43.1 C44.1 C51.1 C52.1 C53.1 U1.H16(VDDSOC_IN) U1.J16(VDDSOC_IN) U1.K16(VDDSOC_IN) U1.L16(VDDSOC_IN) U1.M16(VDDSOC_IN) U1.N16(VDDSOC_IN) U1.P16(VDDSOC_IN) U1.R16(VDDSOC_IN) U1.T16(VDDSOC_IN) U1.U16(VDDSOC_IN)
+2.5V_TRANS: C98.1 C99.1 U1.G18(NVCC_RGMII) U1.R19(NVCC_ENET)
+2.8V_VDD_HIGH: C79.1 C80.1 D1.A U1.H9(VDDHIGH_IN) U1.J9(VDDHIGH_IN)
+3.0V_VSNVS: C100.1 D1.K U1.G11(VDD_SNVS_IN)
+3.3V_IMX6_IO: C81.1 C82.1 C83.1 C84.1 C85.1 C93.1 C94.1 C95.1 C96.1 C97.1 U1.G14(NVCC_SD3) U1.G15(NVCC_NANDF) U1.G16(NVCC_SD1) U1.G17(NVCC_SD2) U1.J7(NVCC_JTAG) U1.K19(NVCC_EIM0) U1.L19(NVCC_EIM1) U1.M19(NVCC_EIM2) U1.N7(NVCC_CSI) U1.P7(NVCC_GPIO) U1.P19(NVCC_LCD)
GND: C12.2 C13.2 C14.2 C15.2 C16.2 C17.2 C18.2 C19.2 C20.2 C21.2 C22.2 C23.2 C24.2 C25.2 C26.2 C27.2 C28.2 C29.2 C30.2 C31.2 C32.2 C33.2 C34.2 C35.2 C36.2 C37.2 C38.2 C39.2 C40.2 C41.2 C42.2 C43.2 C44.2 C45.2 C46.2 C47.2 C48.2 C49.2 C50.2 C51.2 C52.2 C53.2 C54.2 C55.2 C56.2 C57.2 C58.2 C59.2 C60.2 C61.2 C62.2 C63.2 C64.2 C65.2 C66.2 C67.2 C68.2 C69.2 C70.2 C71.2 C72.2 C73.2 C74.2 C75.2 C76.2 C77.2 C78.2 C79.2 C80.2 C81.2 C82.2 C83.2 C84.2 C85.2 C86.2 C87.2 C88.2 C89.2 C90.2 C91.2 C92.2 C93.2 C94.2 C95.2 C96.2 C97.2 C98.2 C99.2 C100.2 C101.2 C102.2 C103.2 C104.2 U1.A4(GND) U1.A5(FA_ANA) U1.A8(GND) U1.A13(GND) U1.A25(GND) U1.AA7(GND) U1.AA10(GND) U1.AA13(GND) U1.AA16(GND) U1.AA19(GND) U1.AA22(GND) U1.AB3(GND) U1.AB24(GND) U1.AD4(GND) U1.AD7(GND) U1.AD10(GND) U1.AD13(GND) U1.AD16(GND) U1.AD19(GND) U1.AD22(GND) U1.AE1(GND) U1.AE25(GND) U1.B4(GND) U1.B5(VDD_FA) U1.C1(GND) U1.C4(GND) U1.C6(GND) U1.C10(GND) U1.D3(GND) U1.D6(GND) U1.D8(GND) U1.E5(GND) U1.E6(GND) U1.E7(GND) U1.F5(GND) U1.F6(GND) U1.F7(GND) U1.F8(GND) U1.G3(GND) U1.G10(GND) U1.G19(GND) U1.H8(GND) U1.H12(GND) U1.H15(GND) U1.H18(GND) U1.J2(GND) U1.J8(GND) U1.J12(GND) U1.J15(GND) U1.J18(GND) U1.K8(GND) U1.K10(GND) U1.K12(GND) U1.K15(GND) U1.K18(GND) U1.L2(GND) U1.L5(GND) U1.L8(GND) U1.L10(GND) U1.L12(GND) U1.L15(GND) U1.L18(GND) U1.M8(GND) U1.M10(GND) U1.M12(GND) U1.M15(GND) U1.M18(GND) U1.N8(GND) U1.N10(GND) U1.N15(GND) U1.N18(GND) U1.P8(GND) U1.P10(GND) U1.P12(GND) U1.P15(GND) U1.P18(GND) U1.R8(GND) U1.R12(GND) U1.R15(GND) U1.R17(GND) U1.T8(GND) U1.T11(GND) U1.T12(GND) U1.T15(GND) U1.T17(GND) U1.T19(GND) U1.U8(GND) U1.U11(GND) U1.U12(GND) U1.U15(GND) U1.U17(GND) U1.U19(GND) U1.V8(GND) U1.V19(GND) U1.W3(GND) U1.W7(GND) U1.W8(GND) U1.W9(GND) U1.W10(GND) U1.W11(GND) U1.W12(GND) U1.W13(GND) U1.W15(GND) U1.W16(GND) U1.W17(GND) U1.W18(GND) U1.W19(GND) U1.Y5(GND) U1.Y24(GND)
NVCC_PLL_OUT: C102.1 C103.1 U1.E8(NVCC_PLL_OUT)
VDD_SNVS_CAP: C101.1 U1.G9(VDD_SNVS_CAP)
VDDARM_CAP: C19.1 C20.1 C21.1 C22.1 C23.1 C32.1 C33.1 C34.1 C35.1 C36.1 U1.H11(VDDARM23_CAP) U1.H13(VDDARM_CAP) U1.J11(VDDARM23_CAP) U1.J13(VDDARM_CAP) U1.K11(VDDARM23_CAP) U1.K13(VDDARM_CAP) U1.L11(VDDARM23_CAP) U1.L13(VDDARM_CAP) U1.M11(VDDARM23_CAP) U1.M13(VDDARM_CAP) U1.N11(VDDARM23_CAP) U1.N13(VDDARM_CAP) U1.P11(VDDARM23_CAP) U1.P13(VDDARM_CAP) U1.R11(VDDARM23_CAP) U1.R13(VDDARM_CAP)
VDDHIGH_CAP: C86.1 C87.1 C88.1 C89.1 C90.1 C91.1 C92.1 U1.G7(PCIE_VPH) U1.G12(SATA_VPH) U1.H10(VDDHIGH_CAP) U1.J10(VDDHIGH_CAP) U1.K7(NVCC_MIPI) U1.M7(HDMI_VPH) U1.V7(NVCC_LVDS2P5)
VDDPU_CAP: C67.1 C68.1 C69.1 C70.1 C71.1 C72.1 U1.H17(VDDPU_CAP) U1.J17(VDDPU_CAP) U1.K17(VDDPU_CAP) U1.L17(VDDPU_CAP) U1.M17(VDDPU_CAP) U1.N17(VDDPU_CAP) U1.P17(VDDPU_CAP)
VDDSOC_CAP: C45.1 C46.1 C47.1 C48.1 C49.1 C50.1 C54.1 C55.1 C56.1 C57.1 C58.1 C59.1 U1.G8(PCIE_VPTX) U1.G13(SATA_VP) U1.H7(PCIE_VP) U1.L7(HDMI_VP) U1.N12(VDD_CACHE_CAP) U1.R10(VDDSOC_CAP) U1.T10(VDDSOC_CAP) U1.T13(VDDSOC_CAP) U1.T14(VDDSOC_CAP) U1.U10(VDDSOC_CAP) U1.U13(VDDSOC_CAP) U1.U14(VDDSOC_CAP)
NetC104_1: C104.1 U1.F9(VDDUSB_CAP)

Not connected (* = marked no-connect by the designer): U1 C8(GPANAIO)*

### Notes on the sheet
- IMX6 POWER
- (in symbol IMX6Q5EYM10AE, part C) IMX6 supply
- (in symbol IMX6Q5EYM10AE, part D) IMX6 IO supply
- (in symbol Title bloc ANSI) APPROVAL; DATE; Designer :; LOGO; Drawn by :; PROJECT TITLE :; Checked by :; DWG TITLE :; PAGE TITLE :; Approved by :; Document number :; REV; SIZE; SHEET; OF

### Library data of the parts
C12-C17 C19-C22 C24-C30 C32-C35 C37-C50 C55-C64 C67-C71 C73-C79 C81-C91 C93-C102 C104 = cap 0.22µ 6.3V: cap solid electrolyte 0.22µ 6.3V 10%; Diélectrique: X5R
C18 C23 C31 C36 C51-C54 C65 C66 C72 C80 C92 C103 = cap 22µ 10V: cap cer 22µ 10V 10% X5R 0603; Diélectrique: X5R
D1 = Diode 1N4148 100V 150mA
TB4 = Title bloc ANSI
U1 = IMX6Q5EYM10AE: as U1 on sheet imx6_ctrl_i2c1; ComponentLink1Description: Manufacturer URL; ComponentLink2Description: Datasheet; DatasheetVersion: Rev. 2.3; ComponentLink3URL: http://cache.freescale.com/files/32bit/doc/data_sheet/IMX6DQCEC.pdf?fpsp=1&WT_TYPE=Data%20Sheets&WT_VENDOR=FREESCALE&WT_FILE_FORMAT=pdf&WT_ASSET=Documentation; ComponentLink1URL: http://www.freescale.com/; Packing: Tape and Reel; Temperature Range: -20 to 105 degC; ComponentLink2URL: http://cache.freescale.com/files/32bit/doc/data_sheet/IMX6DQCEC.pdf?fpsp=1&WT_TYPE=Data%20Sheets&WT_VENDOR=FREESCALE&WT_FILE_FORMAT=pdf&WT_ASSET=Documentation; ComponentLink3Description: Package Specification; PackageVersion: Rev. A; RoHS: TRUE; Quad/Dual CPU: i.MX 6Quad; Mounting Technology: Surface Mount; PackageReference: FCPBGA-624; PackageDescription: 624-pin Ball Grid Array Package, Body 21 x 21mm, Pitch 0.8mm